# EAGLE design 612_jetracer_328_215 (EAGLE 9.6.2)
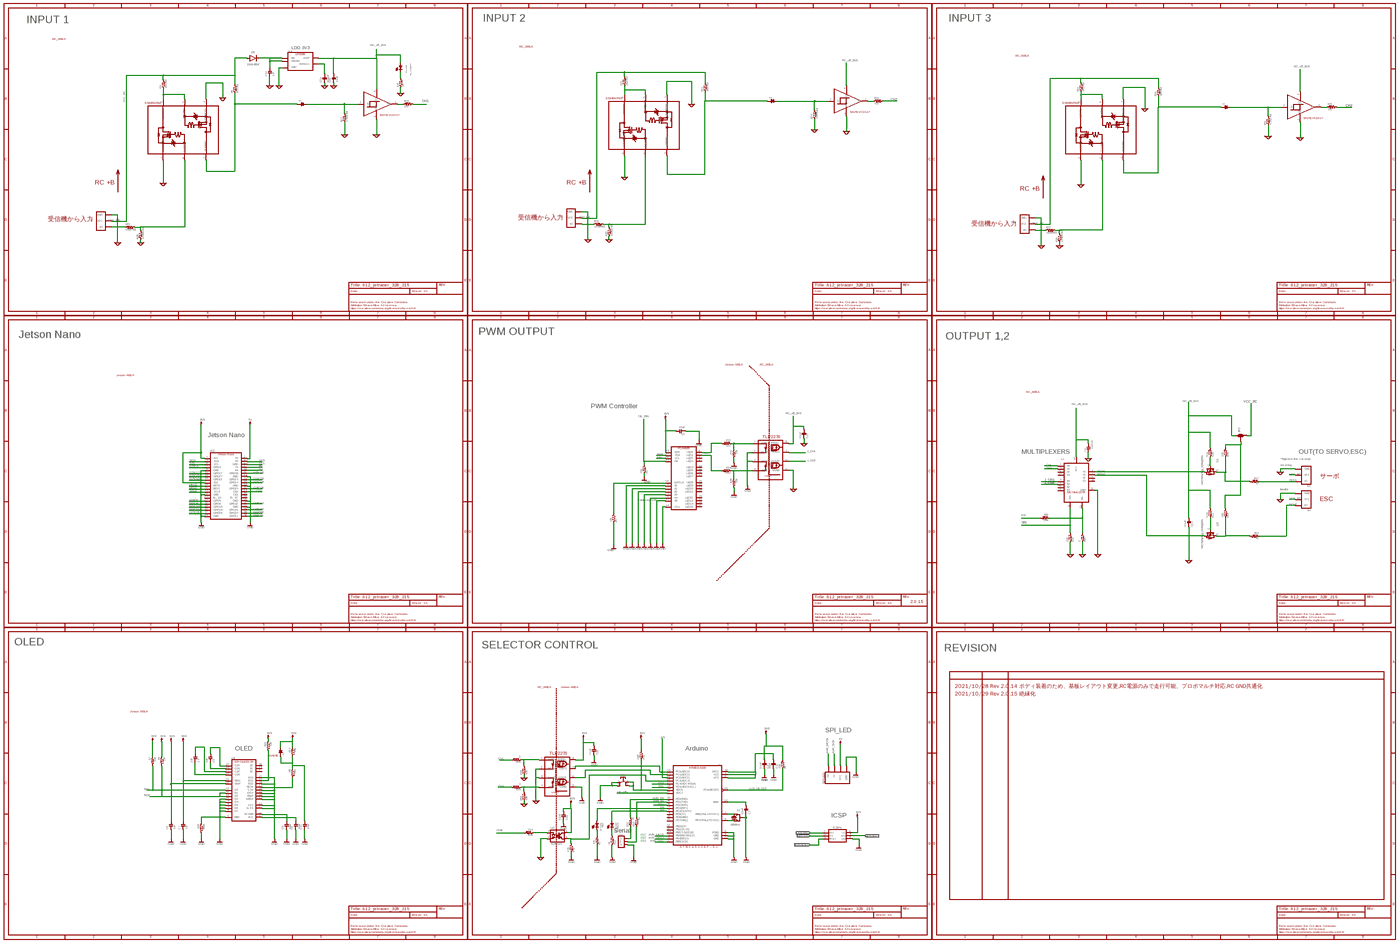
[diagram p0: schematic, sheet 1, overview]
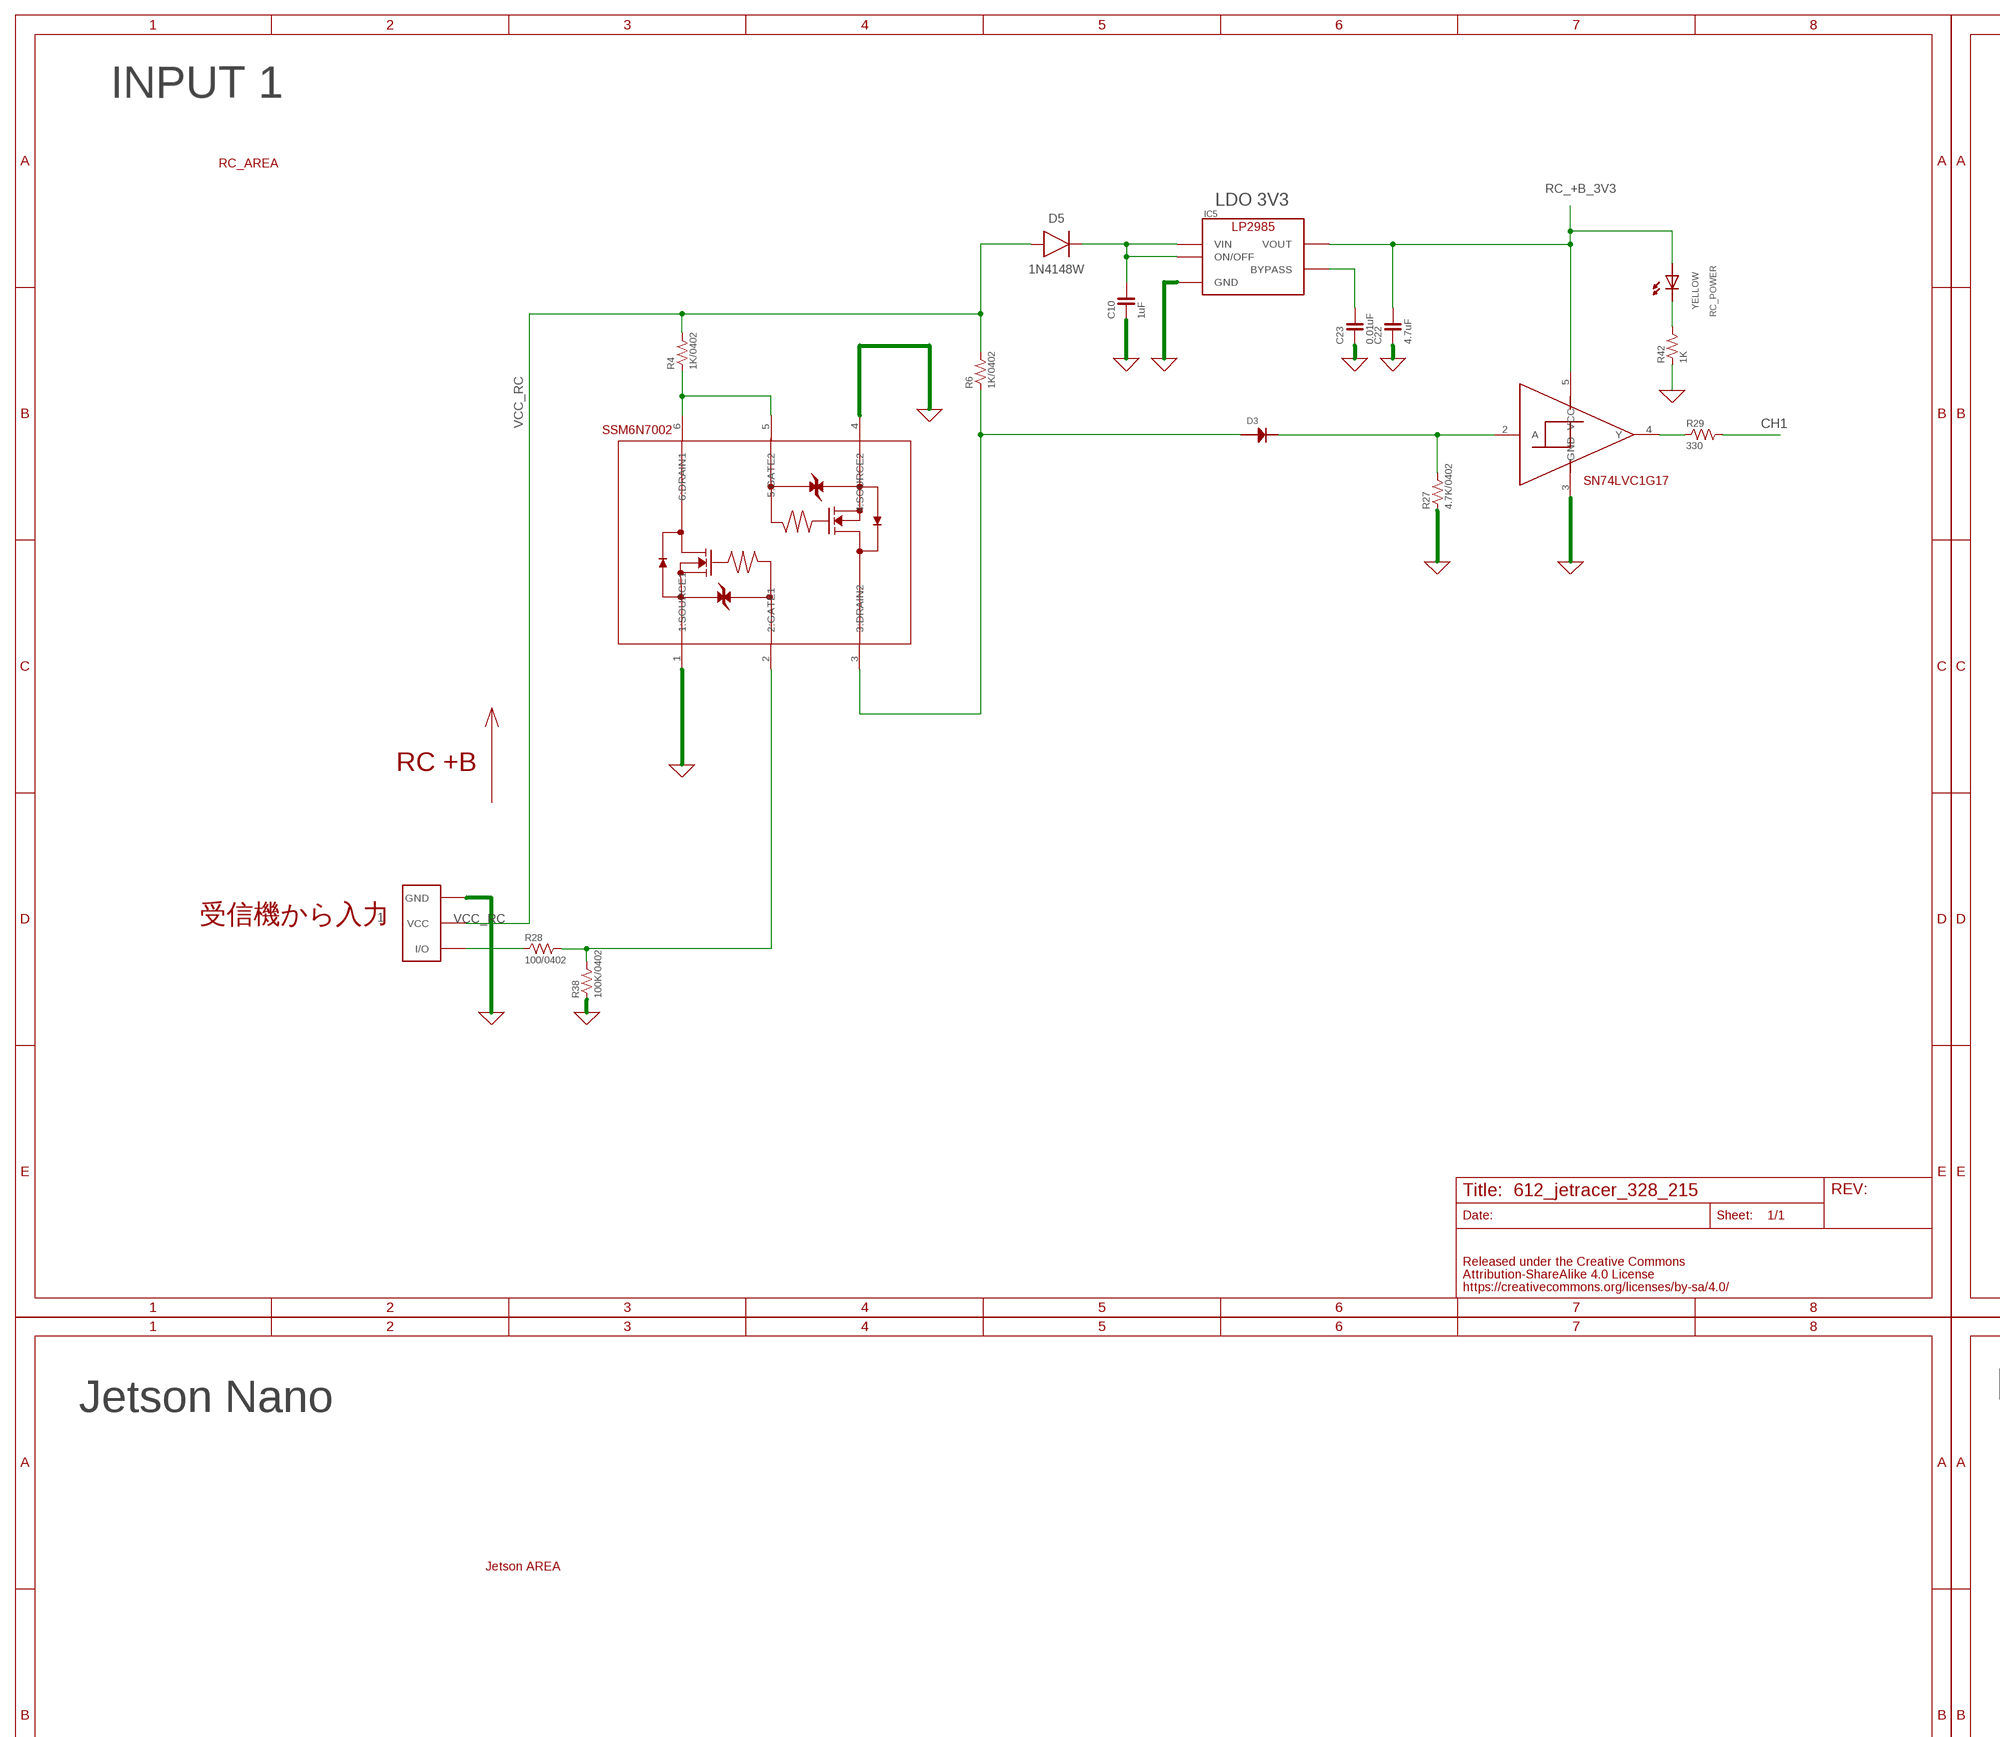
[diagram p1: schematic, sheet 1, part 1 of 8]
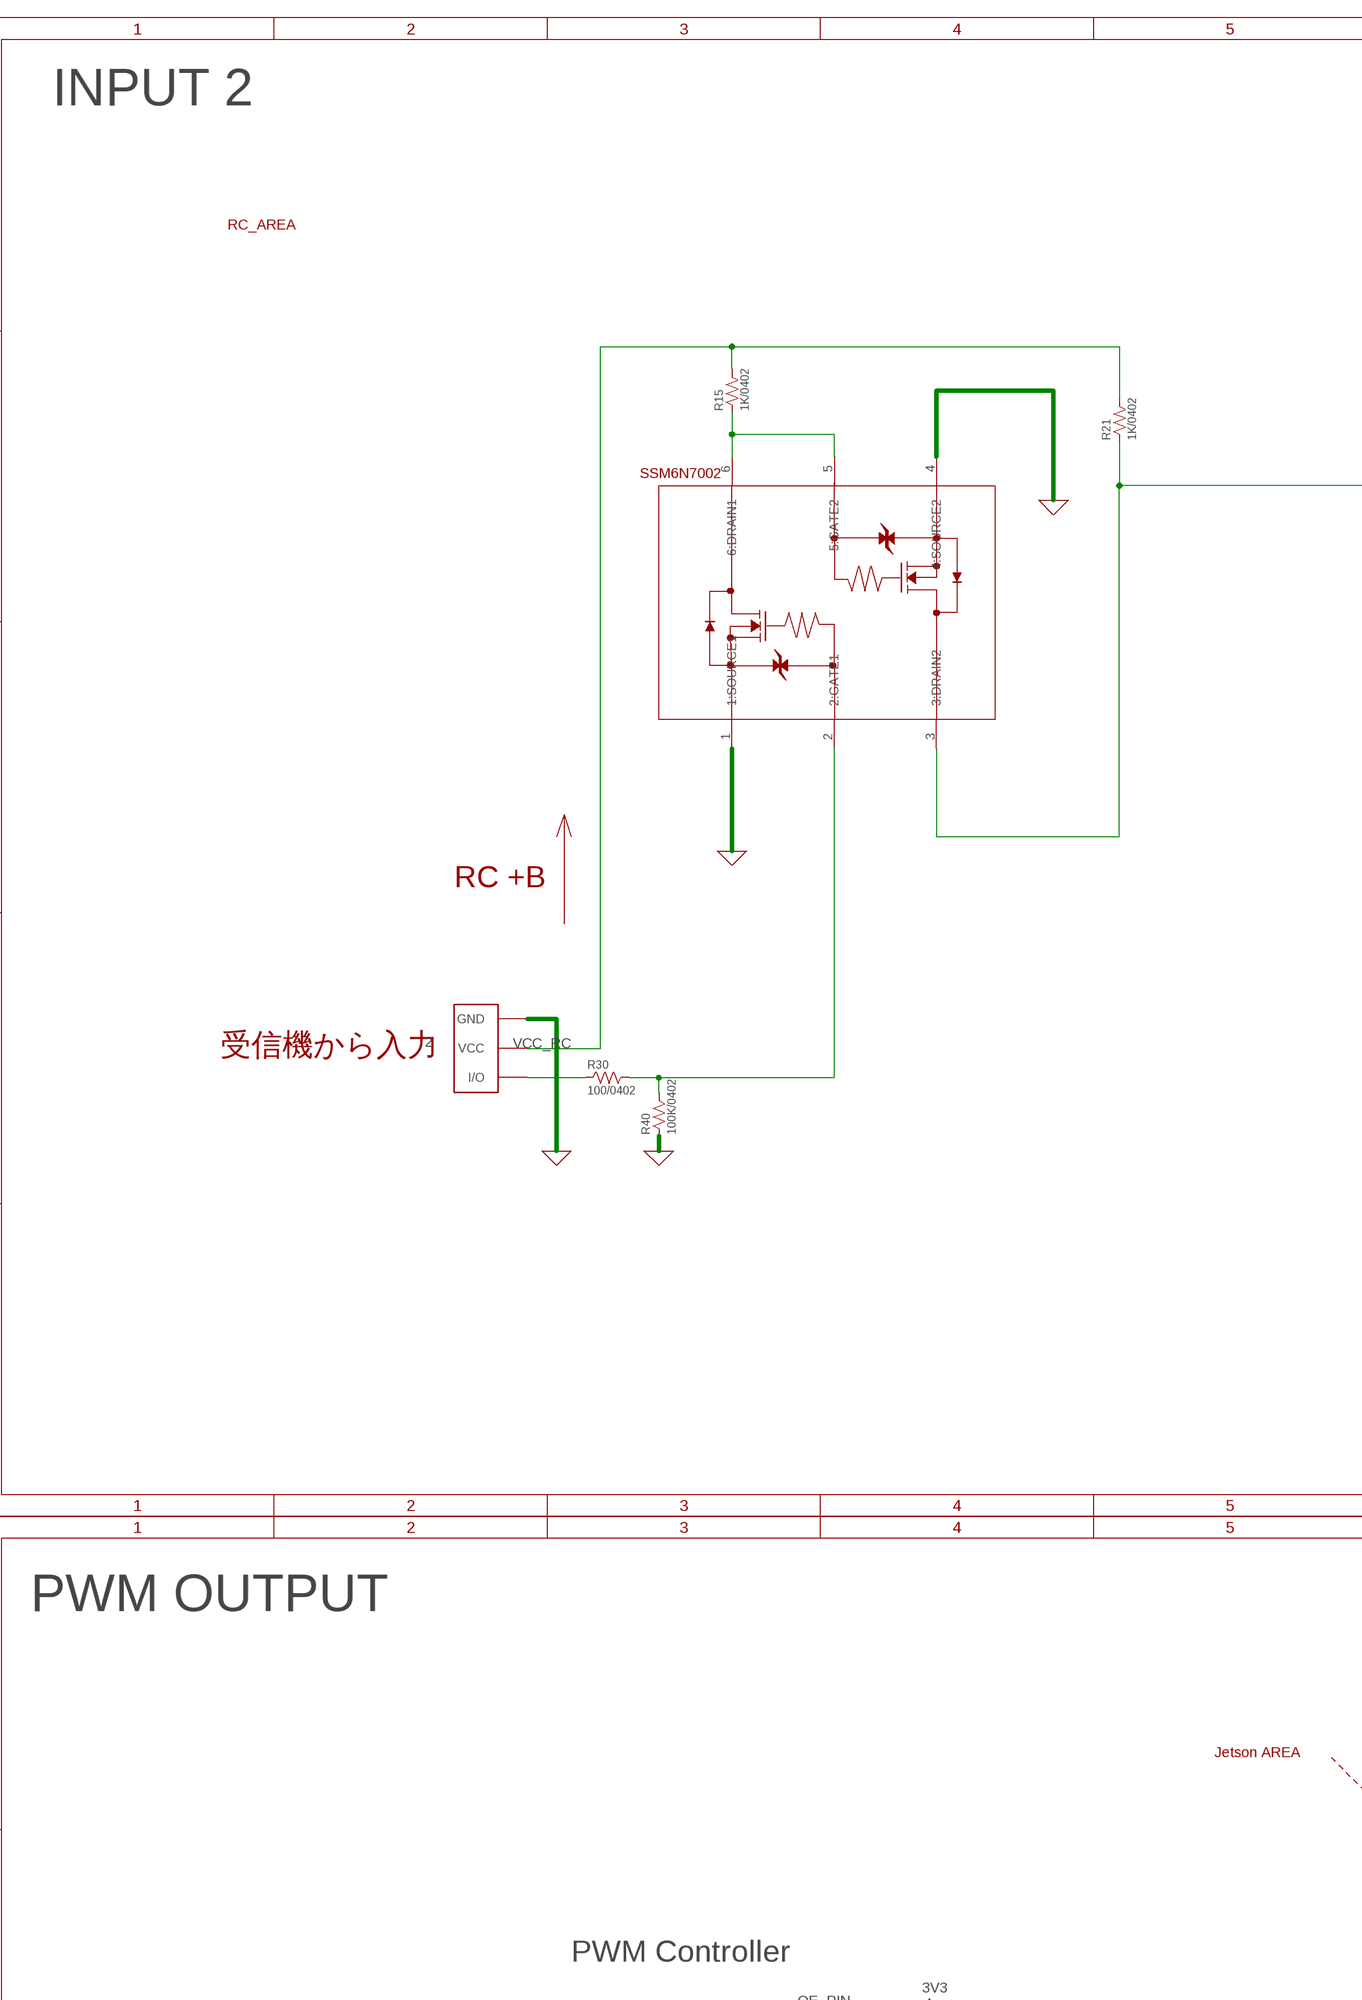
[diagram p2: schematic, sheet 1, part 2 of 8]
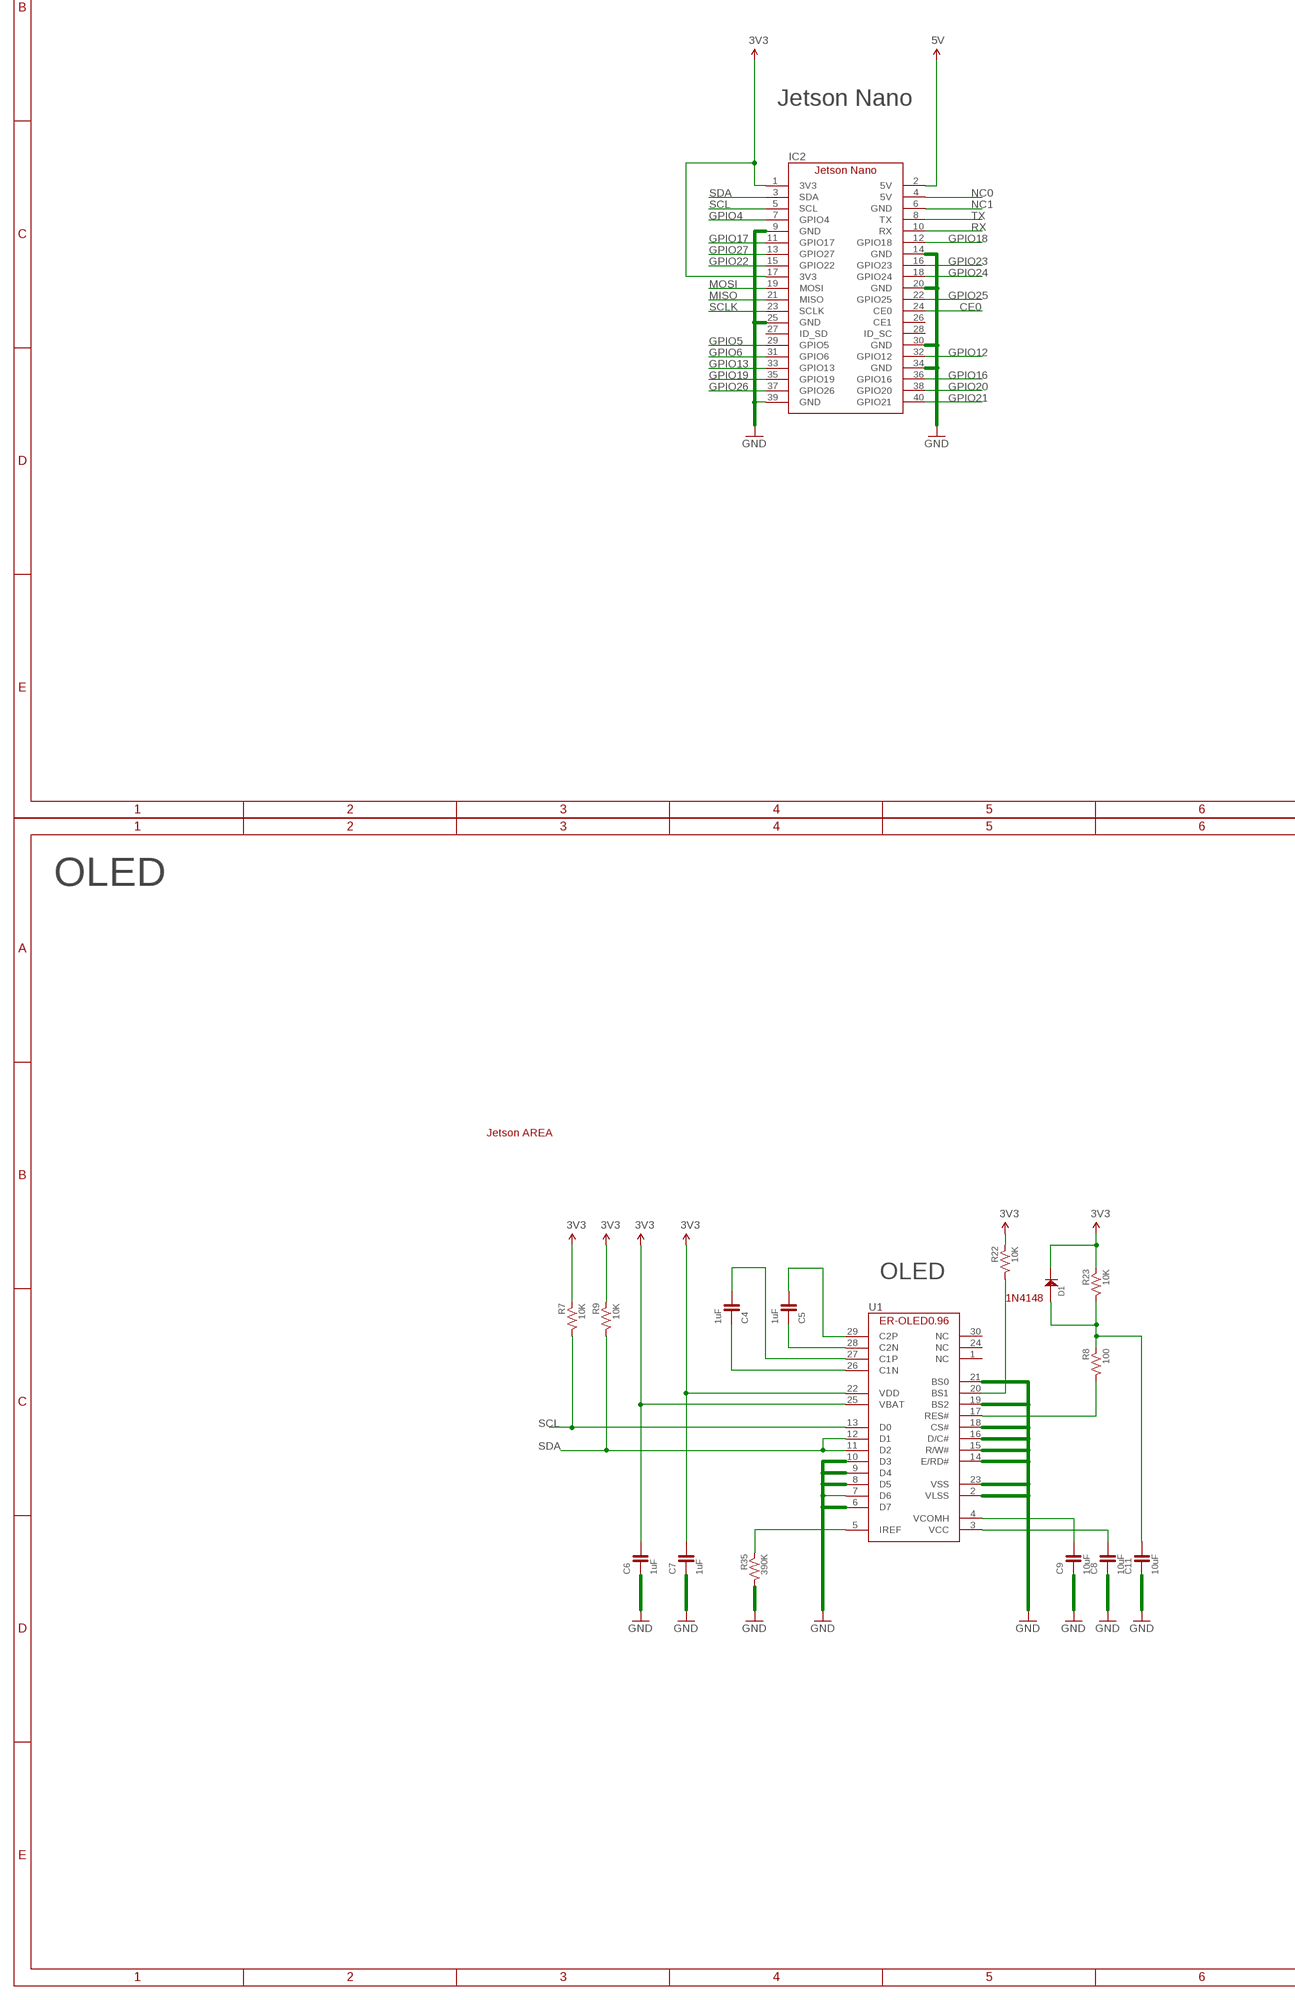
[diagram p3: schematic, sheet 1, part 3 of 8]
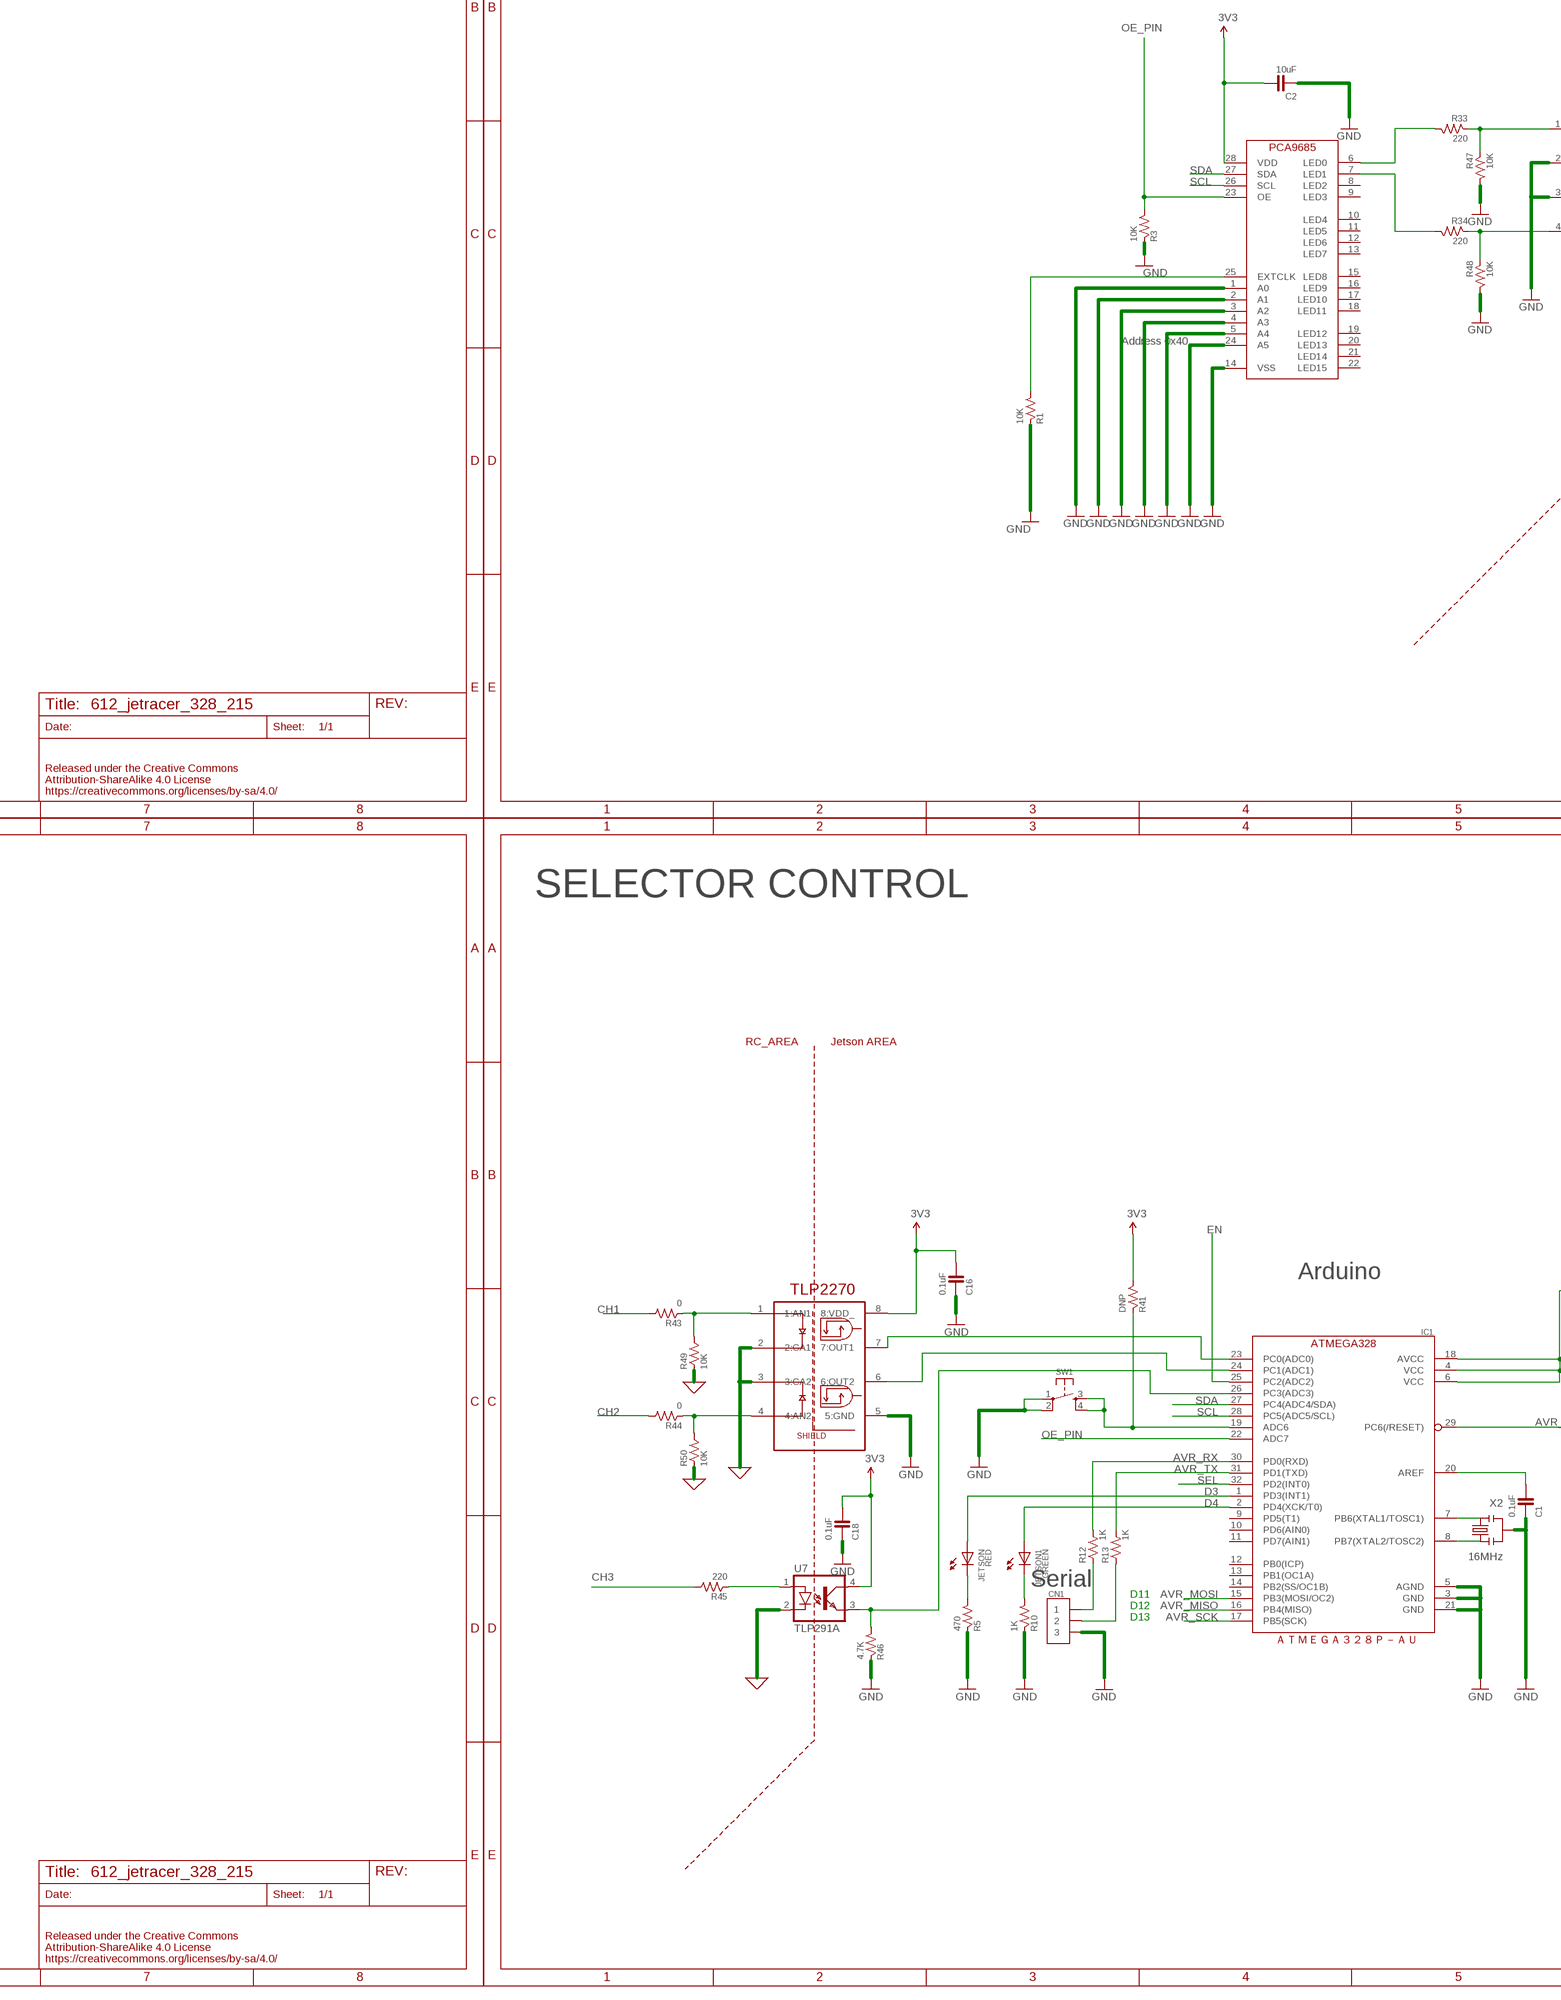
[diagram p4: schematic, sheet 1, part 4 of 8]
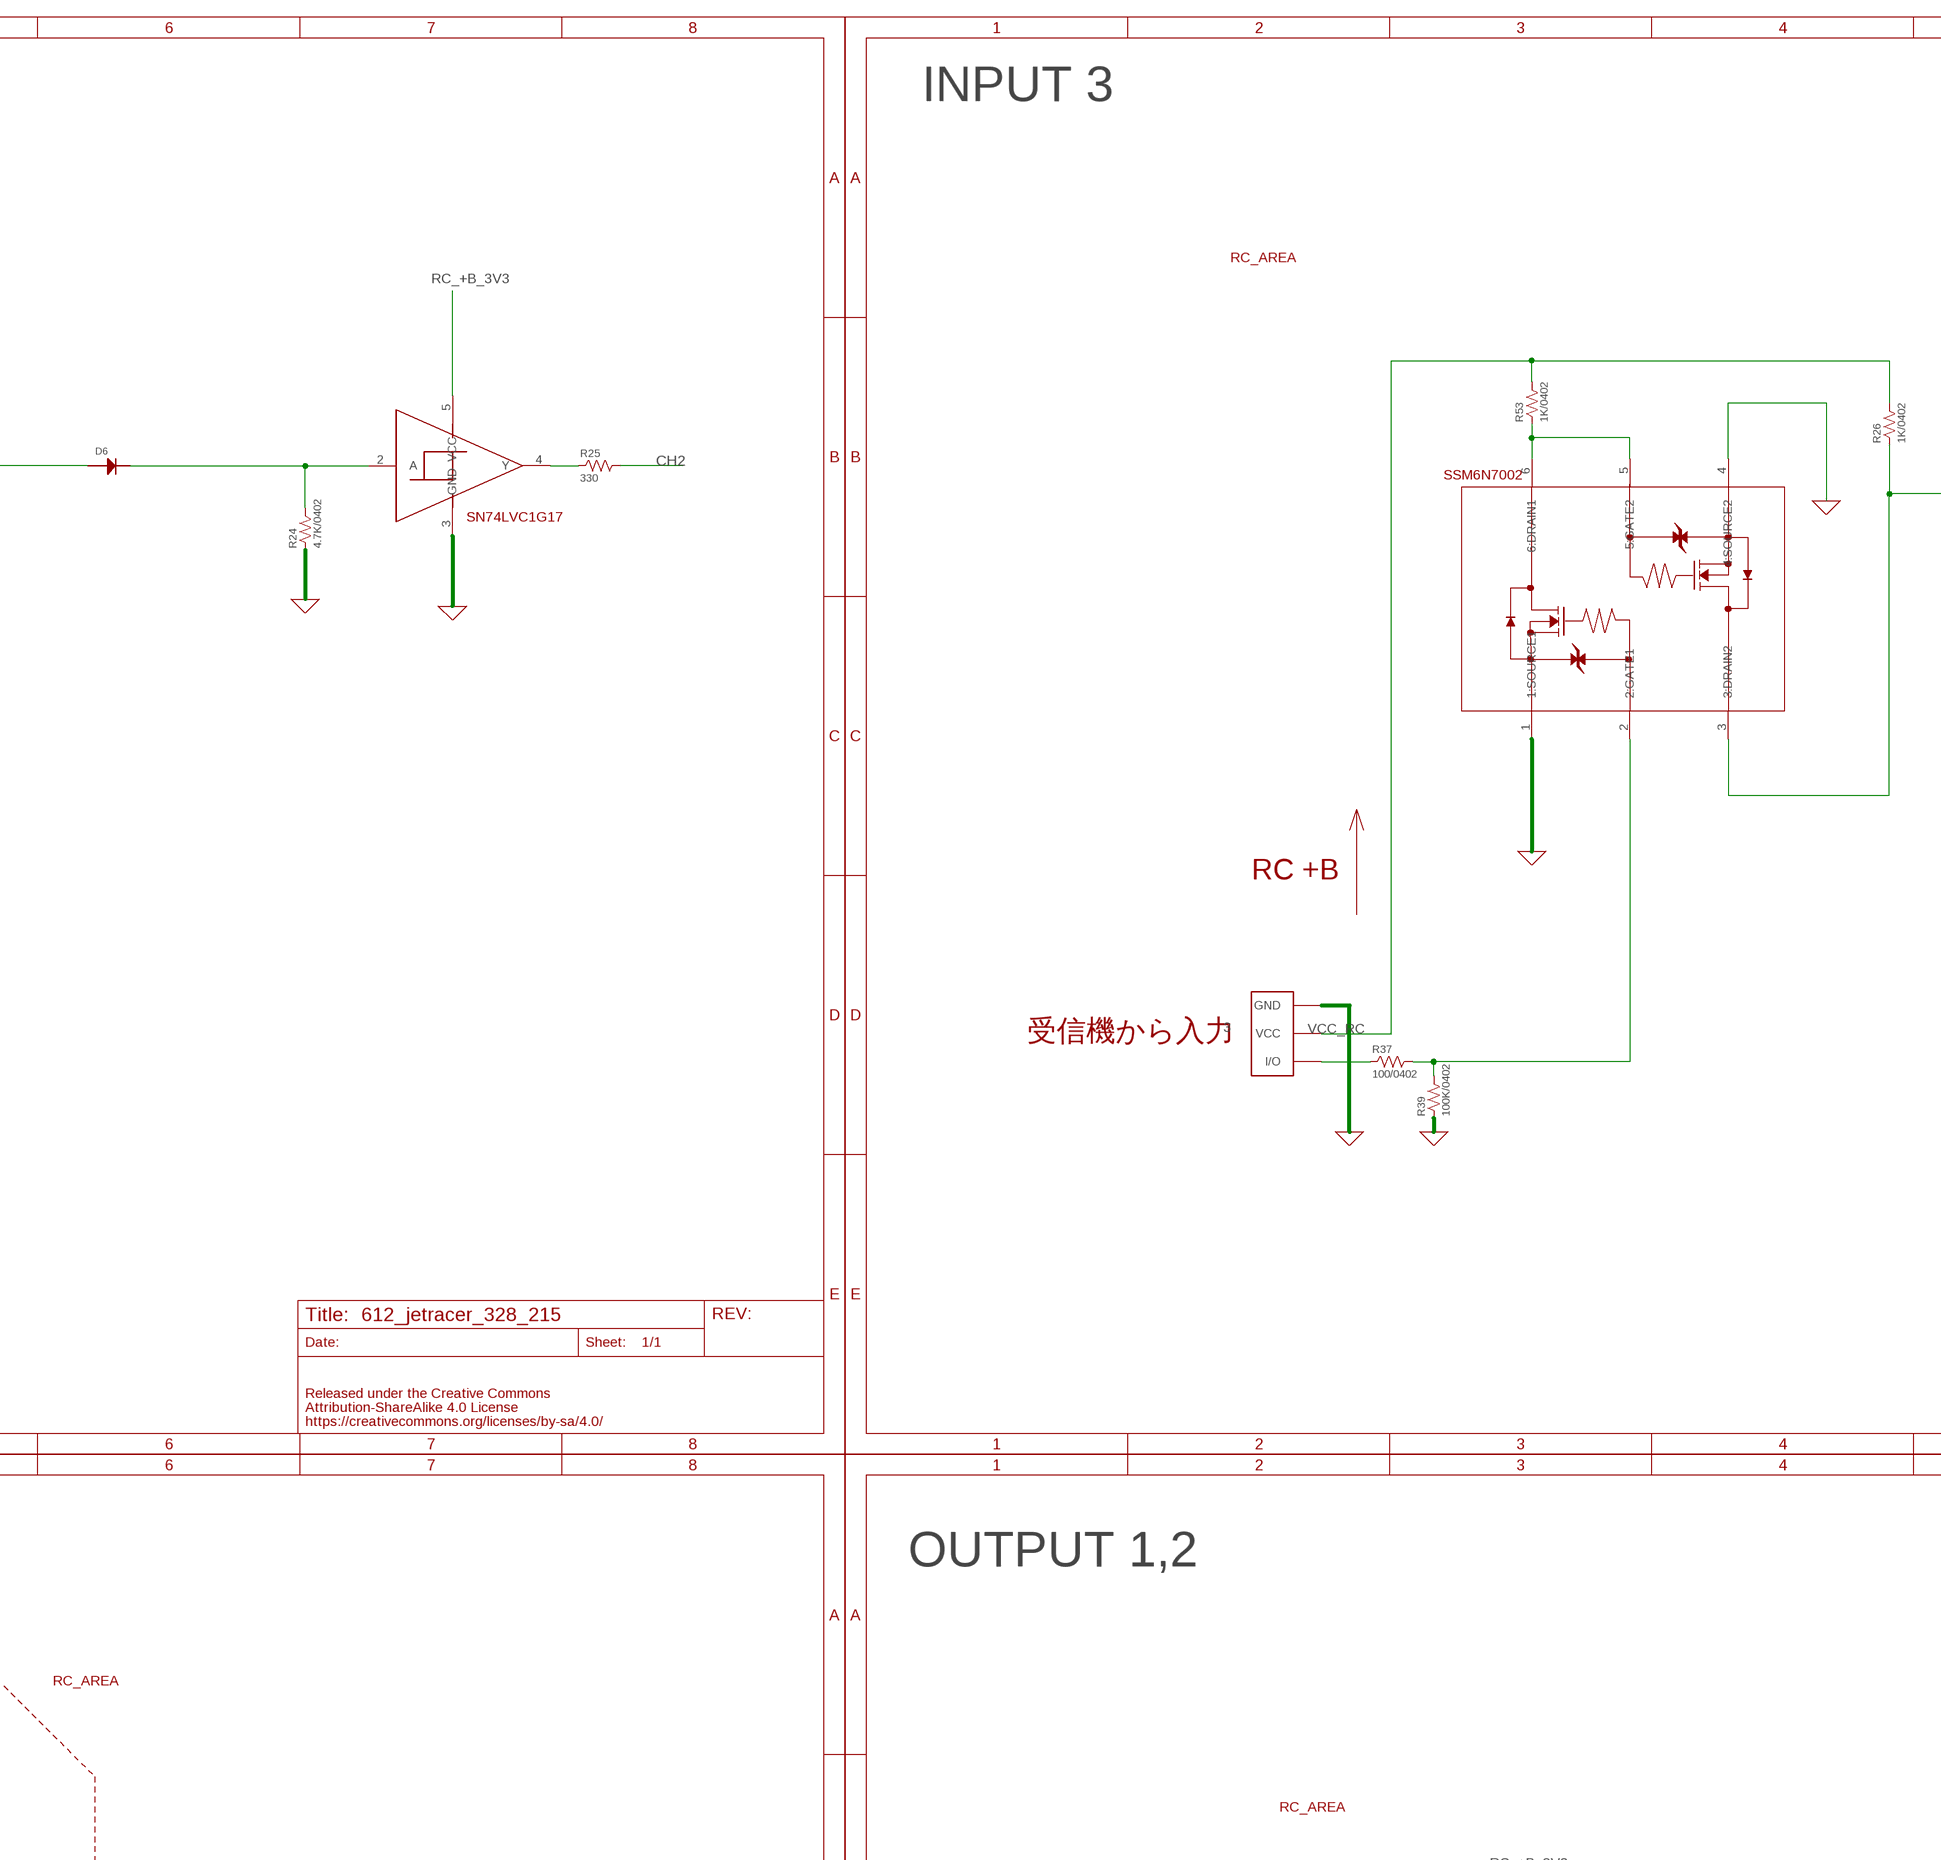
[diagram p5: schematic, sheet 1, part 5 of 8]
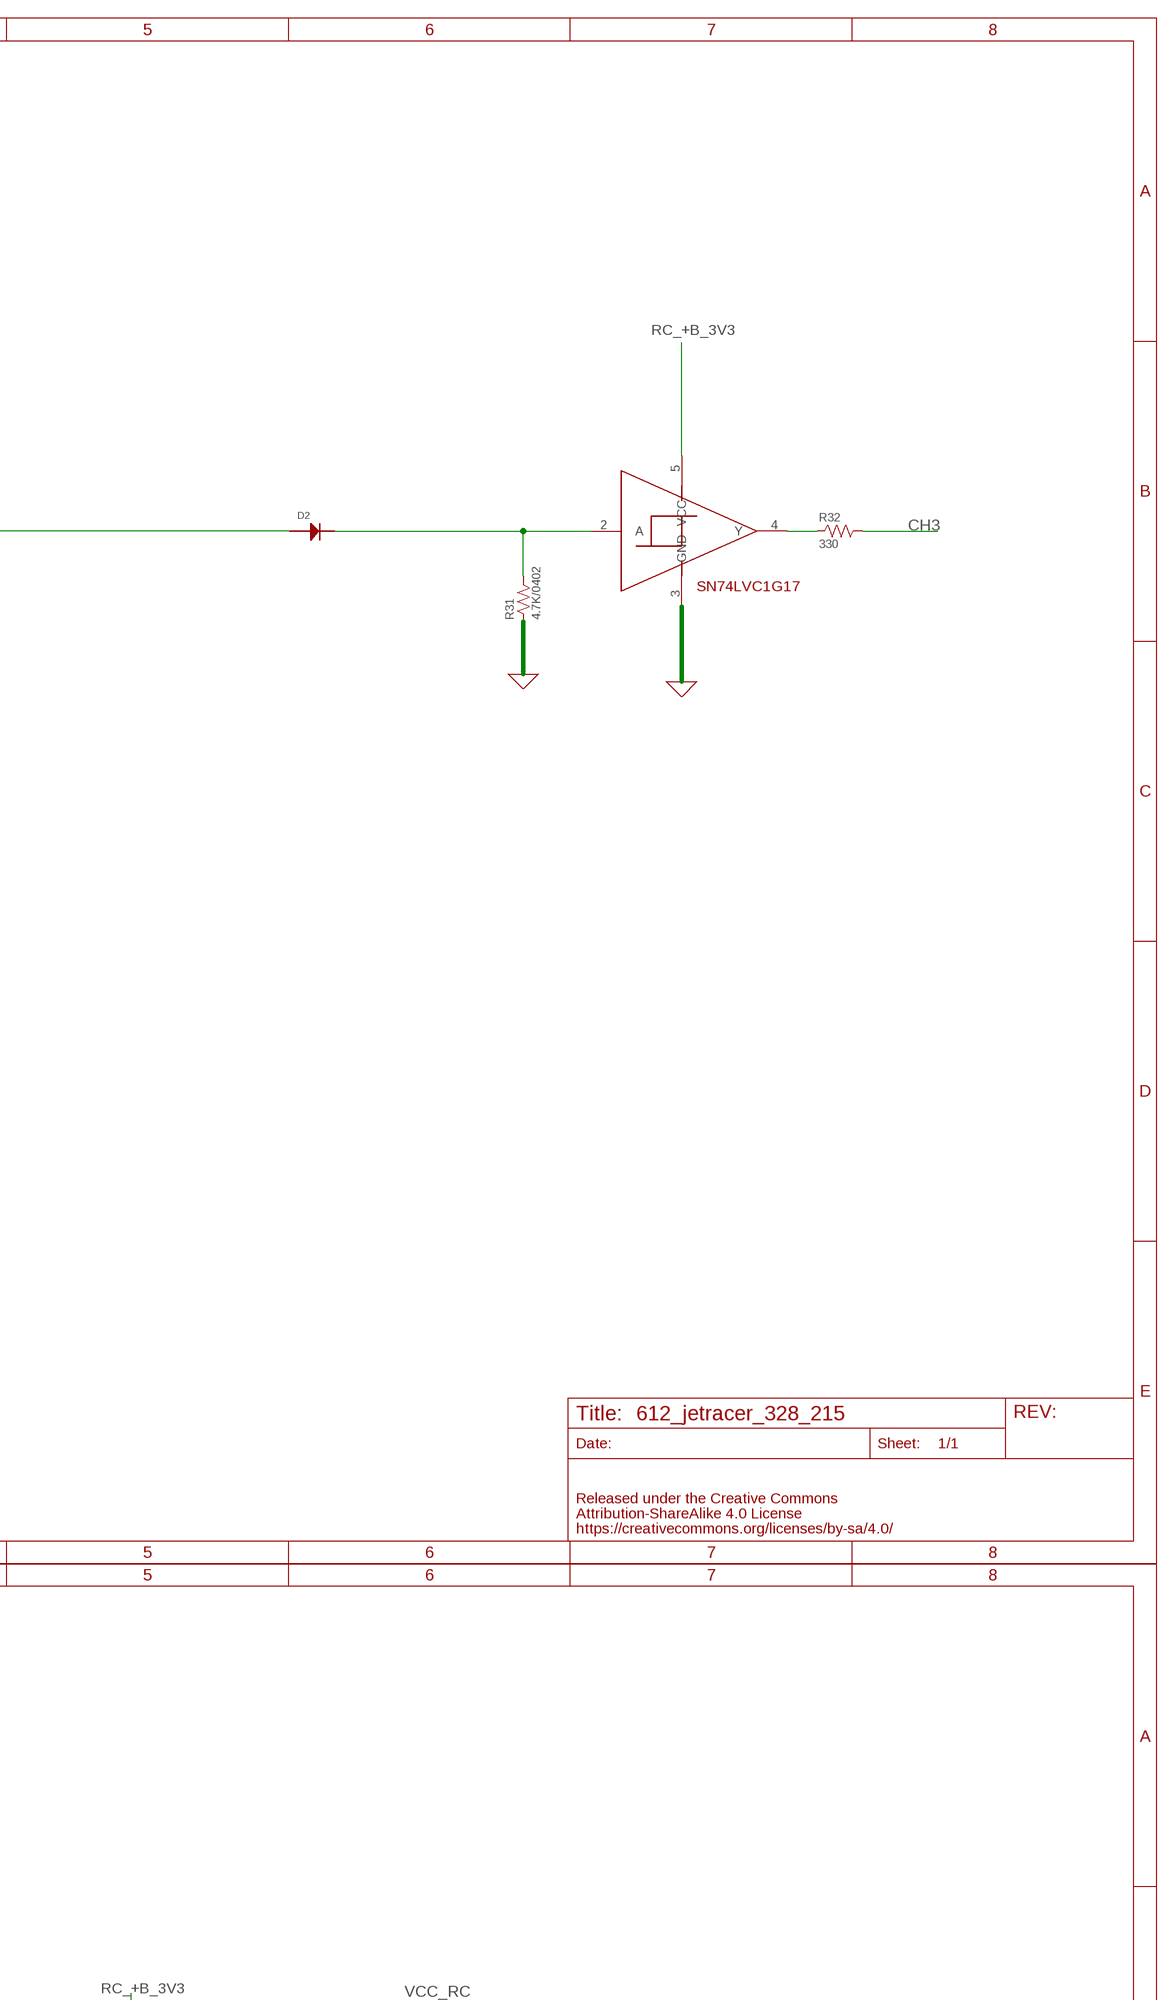
[diagram p6: schematic, sheet 1, part 6 of 8]
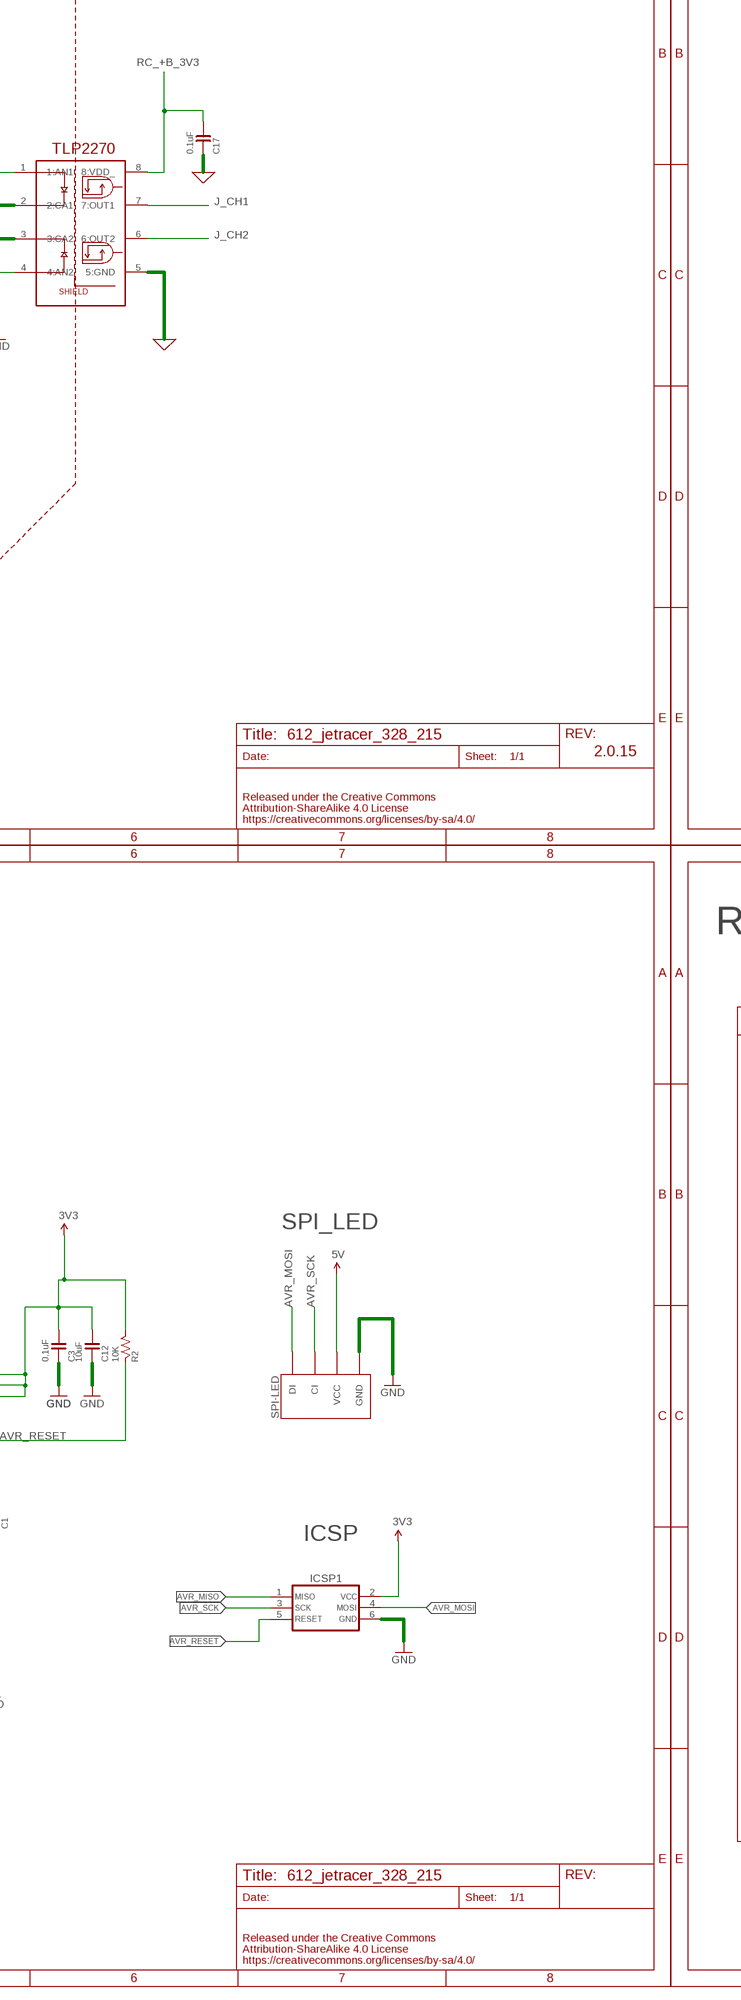
[diagram p7: schematic, sheet 1, part 7 of 8]
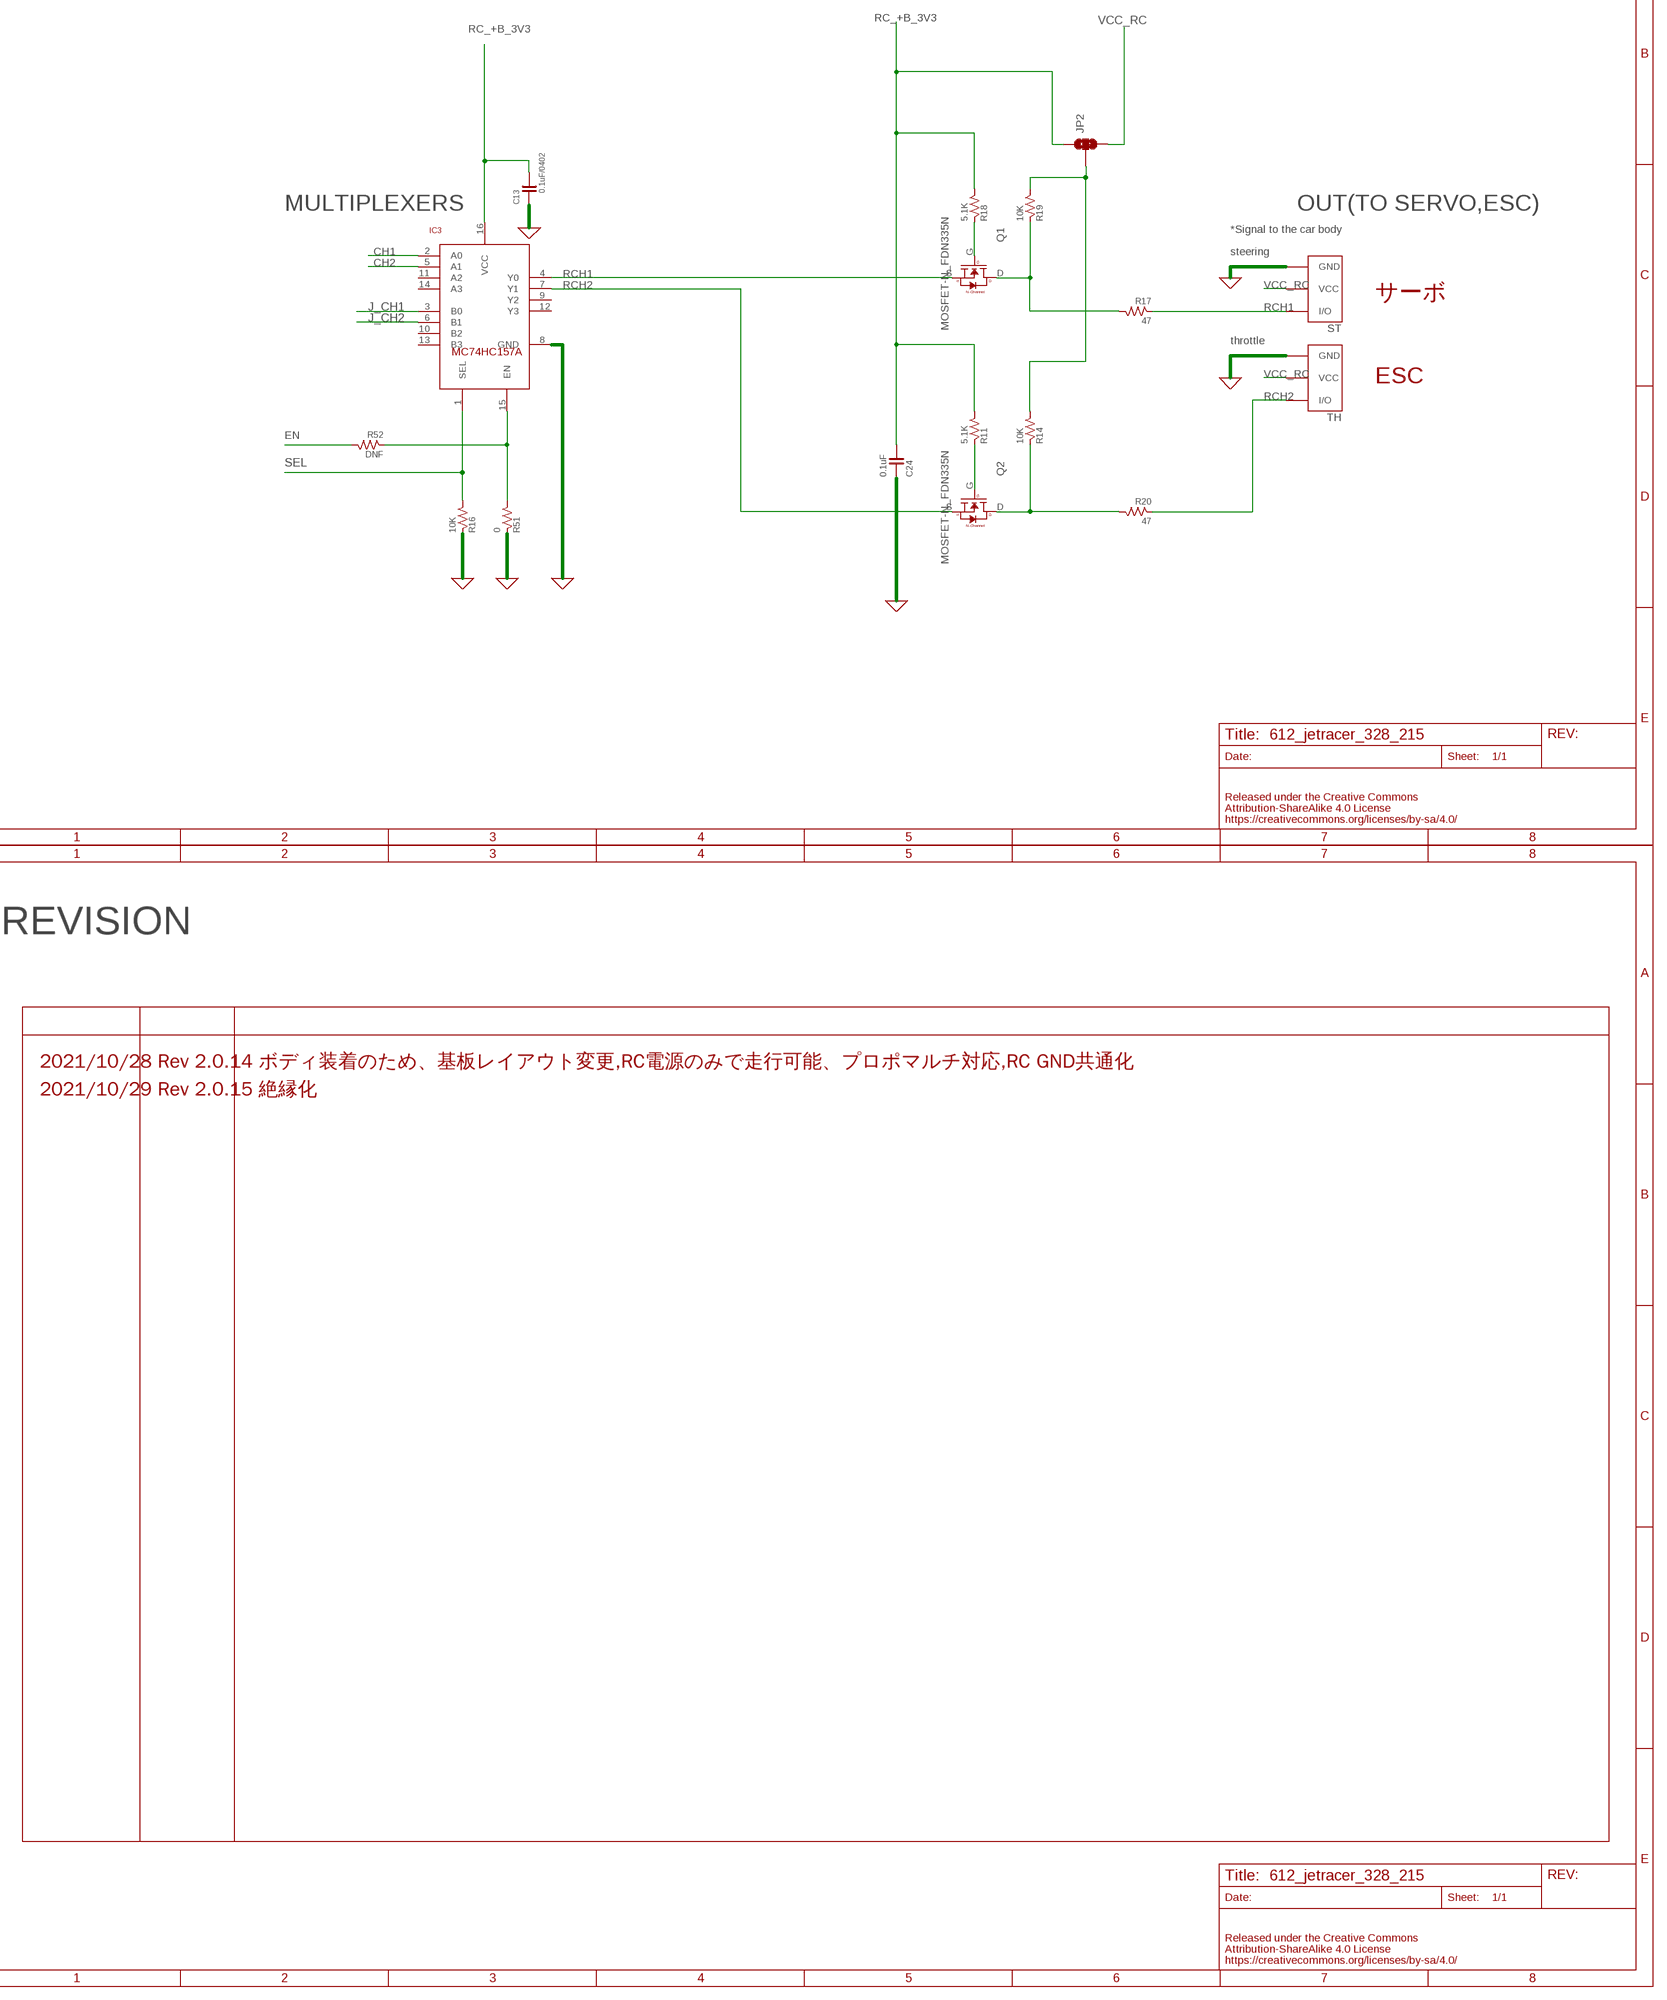
[diagram p8: schematic, sheet 1, part 8 of 8]

## Parts
1  FABO_BRICK_3PIN-HEADER  [FABO_BRICK_3PIN_HEADER]
2  FABO_BRICK_3PIN-HEADER  [FABO_BRICK_3PIN_HEADER]
3  FABO_BRICK_3PIN-HEADER  [FABO_BRICK_3PIN_HEADER]
C1  0.1uF  CAPACITOR-0603  [0603]
C2  10uF  CAPACITOR-0603  [0603]
C3  0.1uF  CAPACITOR-0603  [0603]
C4  1uF  CAPACITOR-0603  [0603]
C5  1uF  CAPACITOR-0603  [0603]
C6  1uF  CAPACITOR-0603  [0603]
C7  1uF  CAPACITOR-0603  [0603]
C8  10uF  CAPACITOR-0603  [0603]
C9  10uF  CAPACITOR-0603  [0603]
C10  1uF  CAPACITOR-0603  [0603]
C11  10uF  CAPACITOR-0603  [0603]
C12  10uF  CAPACITOR-0603  [0603]
C13  0.1uF/0402  CAPACITOR-0402  [0402]
C16  0.1uF  CAPACITOR-0603  [0603]
C17  0.1uF  CAPACITOR-0603  [0603]
C18  0.1uF  CAPACITOR-0603  [0603]
C22  4.7uF  CAPACITOR-0603  [0603]
C23  0.01uF  CAPACITOR-0603  [0603]
C24  0.1uF  CAPACITOR-0603  [0603]
CN1  PIN_1X3  [PIN_1X3]
D1  1N4148  [1N4148W]
D2  DIODE-SOD-323  [SOD-323]
D3  DIODE-SOD-323  [SOD-323]
D5  1N4148W  DIODE_1N4148W-7-F_SOD123G  [SOD3715X135]
D6  DIODE-SOD-323  [SOD-323]
IC1  ATMEGA328P-AU  [TQFP-32]
IC2  JETSON_NANO_NOBORDER  [JETSON_NANO_NOBOARDER]
IC3  MULTIPLEXERSMC74HC157A  [TSSOP-16]
IC4  PCA9685  [PCA9685]
IC5  LP2985-33DBV  [SOT-23-5]
ICSP1  ICSP_AVR-TC_NOHOLE  [TC2030]
JETSON  GREEN  LED-0603  [0603]
JETSON1  RED  LED-0603  [0603]
JP2  JUMPER-SMT_3_1-NC_TRACE_SILK  [SMT-JUMPER_3_1-NC_TRACE_SILK]
Q1  MOSFET-N_FDN335N  [SUPERSOT-3]
Q2  MOSFET-N_FDN335N  [SUPERSOT-3]
R1  10K  RESISTOR-0603  [0603]
R2  10K  RESISTOR-0603  [0603]
R3  10K  RESISTOR-0603  [0603]
R4  1K/0402  RESISTOR-0402  [0402]
R5  470  RESISTOR-0603  [0603]
R6  1K/0402  RESISTOR-0402  [0402]
R7  10K  RESISTOR-0603  [0603]
R8  100  RESISTOR-0603  [0603]
R9  10K  RESISTOR-0603  [0603]
R10  1K  RESISTOR-0603  [0603]
R11  5.1K  RESISTOR-0603  [0603]
R12  1K  RESISTOR-0603  [0603]
R13  1K  RESISTOR-0603  [0603]
R14  10K  RESISTOR-0603  [0603]
R15  1K/0402  RESISTOR-0402  [0402]
R16  10K  RESISTOR-0603  [0603]
R17  47  RESISTOR-0603  [0603]
R18  5.1K  RESISTOR-0603  [0603]
R19  10K  RESISTOR-0603  [0603]
R20  47  RESISTOR-0603  [0603]
R21  1K/0402  RESISTOR-0402  [0402]
R22  10K  RESISTOR-0603  [0603]
R23  10K  RESISTOR-0603  [0603]
R24  4.7K/0402  RESISTOR-0402  [0402]
R25  330  RESISTOR-0603  [0603]
R26  1K/0402  RESISTOR-0402  [0402]
R27  4.7K/0402  RESISTOR-0402  [0402]
R28  100/0402  RESISTOR-0402  [0402]
R29  330  RESISTOR-0603  [0603]
R30  100/0402  RESISTOR-0402  [0402]
R31  4.7K/0402  RESISTOR-0402  [0402]
R32  330  RESISTOR-0603  [0603]
R33  220  RESISTOR-0603  [0603]
R34  220  RESISTOR-0603  [0603]
R35  390K  RESISTOR-0603  [0603]
R37  100/0402  RESISTOR-0402  [0402]
R38  100K/0402  RESISTOR-0402  [0402]
R39  100K/0402  RESISTOR-0402  [0402]
R40  100K/0402  RESISTOR-0402  [0402]
R41  DNP  RESISTOR-0603  [0603]
R42  1K  RESISTOR-0603  [0603]
R43  0  RESISTOR-0603  [0603]
R44  0  RESISTOR-0603  [0603]
R45  220  RESISTOR-0603  [0603]
R46  4.7K  RESISTOR-0603  [0603]
R47  10K  RESISTOR-0603  [0603]
R48  10K  RESISTOR-0603  [0603]
R49  10K  RESISTOR-0603  [0603]
R50  10K  RESISTOR-0603  [0603]
R51  0  RESISTOR-0603  [0603]
R52  DNF  RESISTOR-0603  [0603]
R53  1K/0402  RESISTOR-0402  [0402]
RC_POWER  YELLOW  LED-0603  [0603]
SPI-LED  FABO-SPI-LED-B04B  [SPI-B04B-PASK-1]
ST  FABO_BRICK_3PIN-HEADER  [FABO_BRICK_3PIN_HEADER]
SW1  TACT-SWITCH-SMD_KMR2  [KMR2]
TH  FABO_BRICK_3PIN-HEADER  [FABO_BRICK_3PIN_HEADER]
U1  ER-OLED0.96-1ER-CON30HT-1  [ER-CON30HT-1]
U7  TLP291A  [11-3C1]
U$5  TLP2270  [TLP2270]
U$8  TLP2270  [TLP2270]
U$9  SSM6N7002KFU  [US6]
U$11  SSM6N7002KFU  [US6]
U$14  SN74LVC1G17  [SOT-23]
U$20  SN74LVC1G17  [SOT-23]
U$21  SSM6N7002KFU  [US6]
U$23  SN74LVC1G17  [SOT-23]
X2  16MHz  RESONATOR  [CSTNE_V_C]

## Nets
3V3: C2.2 C3.2 C6.2 C7.2 C12.2 C16.2 C18.2 D1.CATHODE IC1.4(VCC) IC1.6(VCC) IC1.18(AVCC) IC2.1(3V3) IC2.17(3V3) IC4.28(VDD) ICSP1.2 R2.2 R7.1 R9.1 R22.1 R23.1 R41.2 U1.22(VDD) U1.25(VBAT) U7.4(COL) U$8.8(8:VDD_)
5V: IC2.2(5V) SPI-LED.VCC
AVR_MISO: IC1.16(PB4(MISO)) ICSP1.1
AVR_MOSI: IC1.15(PB3(MOSI/OC2)) ICSP1.4 SPI-LED.DI
AVR_RESET: IC1.29(PC6(/RESET)) ICSP1.5 R2.1
AVR_RX: IC1.30(PD0(RXD)) R12.2
AVR_SCK: IC1.17(PB5(SCK)) ICSP1.3 SPI-LED.CI
AVR_TX: IC1.31(PD1(TXD)) R13.2
CE0: IC2.24(CE0)
CH1: IC3.2(A0) R29.2 R43.2
CH2: IC3.5(A1) R25.2 R44.2
CH3: R32.2 R45.2
D3: IC1.1(PD3(INT1)) JETSON1.ANODE
D4: IC1.2(PD4(XCK/T0)) JETSON.ANODE
EN: IC1.25(PC2(ADC2)) R52.2
GND: C1.1 C2.1 C3.1 C6.1 C7.1 C8.1 C9.1 C11.1 C12.1 C16.1 C18.1 CN1.3 IC1.3(GND) IC1.5(AGND) IC1.21(GND) IC2.9(GND) IC2.14(GND) IC2.20(GND) IC2.25(GND) IC2.30(GND) IC2.34(GND) IC2.39(GND) IC4.1(A0) IC4.2(A1) IC4.3(A2) IC4.4(A3) IC4.5(A4) IC4.14(VSS) IC4.24(A5) ICSP1.6 R1.1 R3.1 R5.1 R10.1 R35.2 R46.1 R47.2 R48.2 SPI-LED.GND SW1.1 SW1.2 U1.2(VLSS) U1.6(D7) U1.7(D6) U1.8(D5) U1.9(D4) U1.10(D3) U1.14(E/RD#) U1.15(R/W#) U1.16(D/C#) U1.18(CS#) U1.19(BS2) U1.21(BS0) U1.23(VSS) U$5.2(2:CA1) U$5.3(3:CA2) U$8.5(5:GND) X2.2
GPIO4: IC2.7(GPIO4)
GPIO5: IC2.29(GPIO5)
GPIO6: IC2.31(GPIO6)
GPIO12: IC2.32(GPIO12)
GPIO13: IC2.33(GPIO13)
GPIO16: IC2.36(GPIO16)
GPIO17: IC2.11(GPIO17)
GPIO18: IC2.12(GPIO18)
GPIO19: IC2.35(GPIO19)
GPIO20: IC2.38(GPIO20)
GPIO21: IC2.40(GPIO21)
GPIO22: IC2.15(GPIO22)
GPIO23: IC2.16(GPIO23)
GPIO24: IC2.18(GPIO24)
GPIO25: IC2.22(GPIO25)
GPIO26: IC2.37(GPIO26)
GPIO27: IC2.13(GPIO27)
J_CH1: IC3.3(B0) U$5.7(7:OUT1)
J_CH2: IC3.6(B1) U$5.6(6:OUT2)
MISO: IC2.21(MISO)
MOSI: IC2.19(MOSI)
N$2: R28.2 R38.2 U$9.2(2:GATE1)
N$3: Q1.D R17.2 R19.1
N$4: C1.2 IC1.20(AREF)
N$5: IC1.8(PB7(XTAL2/TOSC2)) X2.3
N$6: CN1.1 R12.1
N$7: IC1.19(ADC6) R41.1 SW1.3 SW1.4
N$8: IC4.25(EXTCLK) R1.2
N$9: Q2.D R14.1 R20.2
N$10: R17.1 ST.I/O
N$11: R30.2 R40.2 U$11.2(2:GATE1)
N$12: D3.A(ANODE) R6.1 U$9.3(3:DRAIN2)
N$13: 2.I/O R30.1
N$14: R20.1 TH.I/O
N$15: IC1.7(PB6(XTAL1/TOSC1)) X2.1
N$16: C4.2 U1.27(C1P)
N$17: CN1.2 R13.1
N$18: R15.1 U$11.5(5:GATE2) U$11.6(6:DRAIN1)
N$19: JETSON1.CATHODE R5.2
N$20: JETSON.CATHODE R10.2
N$21: C4.1 U1.26(C1N)
N$22: C5.1 U1.28(C2N)
N$23: C5.2 U1.29(C2P)
N$24: R35.1 U1.5(IREF)
N$25: C9.2 U1.4(VCOMH)
N$26: C8.2 U1.3(VCC)
N$27: R8.2 U1.17(RES#)
N$28: C11.2 D1.ANODE R8.1 R23.2
N$29: D6.A(ANODE) R21.1 U$11.3(3:DRAIN2)
N$30: D6.K(CATHODE) R24.2 U$20.2(A)
N$31: R25.1 U$20.4(Y)
N$32: 3.I/O R37.1
N$33: R53.1 U$21.5(5:GATE2) U$21.6(6:DRAIN1)
N$34: D3.K(CATHODE) R27.2 U$14.2(A)
N$35: R29.1 U$14.4(Y)
N$36: D2.A(ANODE) R26.1 U$21.3(3:DRAIN2)
N$37: D2.K(CATHODE) R31.2 U$23.2(A)
N$38: R32.1 U$23.4(Y)
N$39: Q2.G R11.1
N$40: Q1.G R18.1
N$41: JP2.2 R14.2 R19.2
N$42: IC4.6(LED0) R33.2
N$43: IC4.7(LED1) R34.2
N$44: 1.I/O R28.1
N$45: IC3.15(EN) R51.2 R52.1
N$46: R37.2 R39.2 U$21.2(2:GATE1)
N$47: C23.2 IC5.4(BYPASS)
N$48: C10.2 D5.1(C) IC5.1(VIN) IC5.3(ON/OFF)
N$49: R42.2 RC_POWER.CATHODE
N$50: R22.2 U1.20(BS1)
N$53: R33.1 R47.1 U$5.1(1:AN1)
N$54: R34.1 R48.1 U$5.4(4:AN2)
N$55: IC1.23(PC0(ADC0)) U$8.7(7:OUT1)
N$56: IC1.24(PC1(ADC1)) U$8.6(6:OUT2)
N$57: R43.1 R49.2 U$8.1(1:AN1)
N$58: R44.1 R50.2 U$8.4(4:AN2)
N$59: R45.1 U7.1(A)
N$60: IC1.26(PC3(ADC3)) R46.2 U7.3(EMI)
N$61: R4.1 U$9.5(5:GATE2) U$9.6(6:DRAIN1)
NC0: IC2.4(5V)
NC1: IC2.6(GND)
OE_PIN: IC1.22(ADC7) IC4.23(OE) R3.2
RC_+B_3V3: C13.2 C17.2 C22.2 C24.2 IC3.16(VCC) IC5.5(VOUT) JP2.1 R11.2 R18.2 RC_POWER.ANODE U$5.8(8:VDD_) U$14.5(VCC) U$20.5(VCC) U$23.5(VCC)
RC_GND: 1.GND 2.GND 3.GND C10.1 C13.1 C17.1 C22.1 C23.1 C24.1 IC3.8(GND) IC5.2(GND) R16.1 R24.1 R27.1 R31.1 R38.1 R39.1 R40.1 R42.1 R49.1 R50.1 R51.1 ST.GND TH.GND U7.2(C) U$5.5(5:GND) U$8.2(2:CA1) U$8.3(3:CA2) U$9.1(1:SOURCE1) U$9.4(4:SOURCE2) U$11.1(1:SOURCE1) U$11.4(4:SOURCE2) U$14.3(GND) U$20.3(GND) U$21.1(1:SOURCE1) U$21.4(4:SOURCE2) U$23.3(GND) ; supply symbol labelled GND
RCH1: IC3.4(Y0) Q1.S
RCH2: IC3.7(Y1) Q2.S
RX: IC2.10(RX)
SCL: IC1.28(PC5(ADC5/SCL)) IC2.5(SCL) IC4.26(SCL) R7.2 U1.13(D0)
SCLK: IC2.23(SCLK)
SDA: IC1.27(PC4(ADC4/SDA)) IC2.3(SDA) IC4.27(SDA) R9.2 U1.11(D2) U1.12(D1)
SEL: IC1.32(PD2(INT0)) IC3.1(SEL) R16.2
TX: IC2.8(TX)
VCC_RC: 1.VCC 2.VCC 3.VCC D5.2(A) JP2.3 R4.2 R6.2 R15.2 R21.2 R26.2 R53.2 ST.VCC TH.VCC
Unconnected: IC1.9(PD5(T1)) IC1.10(PD6(AIN0)) IC1.11(PD7(AIN1)) IC1.12(PB0(ICP)) IC1.13(PB1(OC1A)) IC1.14(PB2(SS/OC1B)) IC2.26(CE1) IC2.27(ID_SD) IC2.28(ID_SC) IC3.9(Y2) IC3.10(B2) IC3.11(A2) IC3.12(Y3) IC3.13(B3) IC3.14(A3) IC4.8(LED2) IC4.9(LED3) IC4.10(LED4) IC4.11(LED5) IC4.12(LED6) IC4.13(LED7) IC4.15(LED8) IC4.16(LED9) IC4.17(LED10) IC4.18(LED11) IC4.19(LED12) IC4.20(LED13) IC4.21(LED14) IC4.22(LED15) U1.1(NC) U1.24(NC) U1.30(NC)

## Notes on the sheet
- INPUT 1 | INPUT 2 | INPUT 3
- RC_AREA
- RC_AREA
- LDO 3V3
- RC_AREA
- SN74LVC1G17
- SN74LVC1G17
- SN74LVC1G17
- RC +B | RC +B
- RC +B
- 受信機から入力 | 受信機から入力
- 受信機から入力
- Jetson Nano | PWM OUTPUT
- OUTPUT 1,2
- Jetson AREA | RC_AREA
- Jetson AREA
- RC_AREA
- PWM Controller
- Jetson Nano
- MULTIPLEXERS | OUT(TO SERVO,ESC)
- *Signal to the car body
- steering
- サーボ
- throttle
- MC74HC157A
- Address 0x40 | ESC
- 2.0.15
- OLED | SELECTOR CONTROL
- REVISION
- RC_AREA | Jetson AREA | 2021/10/28 Rev 2.0.14 ボディ装着のため、基板レイアウト変更,RC電源のみで走行可能、プロポマルチ対応,RC GND共通化
- 2021/10/29 Rev 2.0.15 絶縁化
- Jetson AREA
- SPI_LED
- OLED | Arduino
- 1N4148
- ICSP
- Serial
- D11
- D12
- D13
- ＡＴＭＥＧＡ３２８Ｐ－ＡＵ

## Library data of the parts
1-3 ST TH = FaBo-Template:FABO_BRICK_3PIN: FaBo Brick 3pin
C1-C13 C16-C18 C22 C23 = FaBo-Capacitor:CAPACITOR: CAPACITOR
C24 = FaBo-Capacitor:CAPACITOR: CAPACITOR; SPICEPREFIX: C
CN1 = FaBo-PIN:PIN_1X3
D1 = FaBo-Diode:1N4148
D2 D3 D6 = FaBo-Diode:DIODE
D5 = Diode:DIODE_: Diode Rectifier - Popular parts; CATEGORY: Diode; DESCRIPTION: DIODE GEN PURP 100V 300MA SOD123; MANUFACTURER: Diodes Incorporated; SUB-CATEGORY: Rectifier
IC1 = component:ATMEGA328
IC2 = FaBo-Boards:JETSON_NANO
IC3 = FaBo-Multiplexers:MULTIPLEXERS
IC4 = FaBo-Motor:PCA9685
IC5 = FaBo-Supply:LP2985: LP2985
ICSP1 = component:ICSP_AVR
JETSON JETSON1 RC_POWER = FaBo-LED:LED
JP2 = SparkFun-Jumpers:JUMPER-SMT_3_1-NC_TRACE: Normally closed trace jumper (1 of 2 connections) This jumper has a trace between two pads so it's normally closed (NC). The other connection is normally open (NO). Use a razor knife to open the connection. For best results follow the IPC guidelines for cutting traces: Cutout at least 0.063 mm (0.005 in). Remove all loose material to clean up the cut area. Seal the cut with an approved epoxy. Reapply solder to reclose the connection, or to close the NO connection.
Q1 Q2 = FaBo-Mosfet:MOSFET-N
R1-R35 R37-R53 = FaBo-Resistors:RESISTOR: RESISTOR
SPI-LED = FaBo-Connetor:FABO-SPI-LED
SW1 = FaBo-Switch:TACT-SWITCH: Part No Maker Datasheet Distributor 1273HA-160G-G SWITRONIC Catalog <http://www.switronic.com/uploads/images/A10.gif> Akizuki <http://akizukidenshi.com/catalog/g/gP-02561/> DTS-6-V Cosland DTS 6 Series <http://www.cosland.com/newproduct/DTS%20SERIES.pdf> Akizuki <http://akizukidenshi.com/catalog/g/gP-03647/> KMR2 C&K KMR2 SERIES <https://www.ckswitches.com/products/switches/product-details/Tactile/KMR2/> Octoparts Result <https://octopart.com/search?q=KMR2&start=0> TSHA-T-XB2-19E TOP UP INDUSTORY TSHA-T <http://www.top-up.com.tw/front/bin/ptdetail.phtml?Part=TSHA-T> Akizuki <http://akizukidenshi.com/catalog/g/gP-09361/>
U1 = FaBo-Display:ER-OLED0.96-1
U7 = FaBo_Photocoupler:TLP291A; SPICEPREFIX: E
U$5 U$8 = FaBo_Photocoupler:TLP2270
U$9 U$11 U$21 = FaBo-Mosfet:SSM6N7002KFU
U$14 U$20 U$23 = FaBo-LogicIC:SN74LVC1G17
X2 = component:RESONATOR

## Board
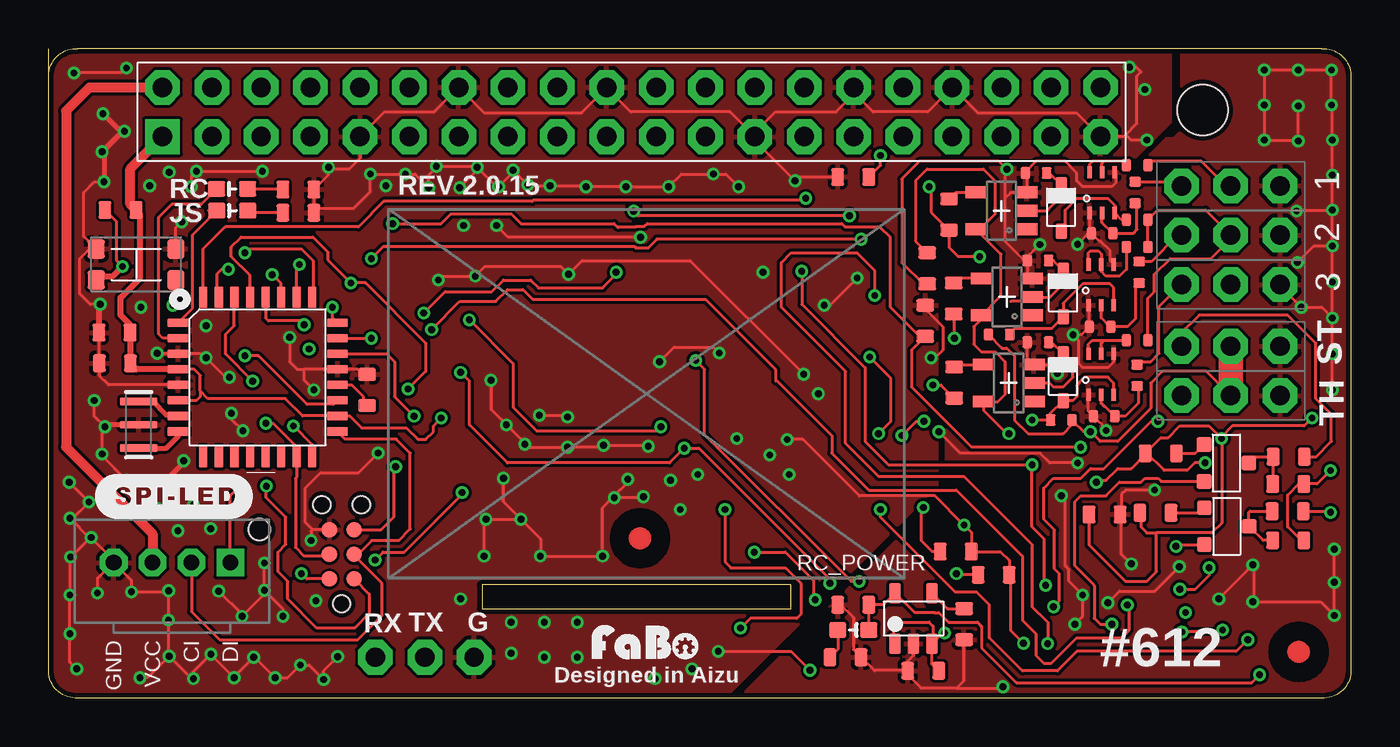
[diagram p9: board, top side]
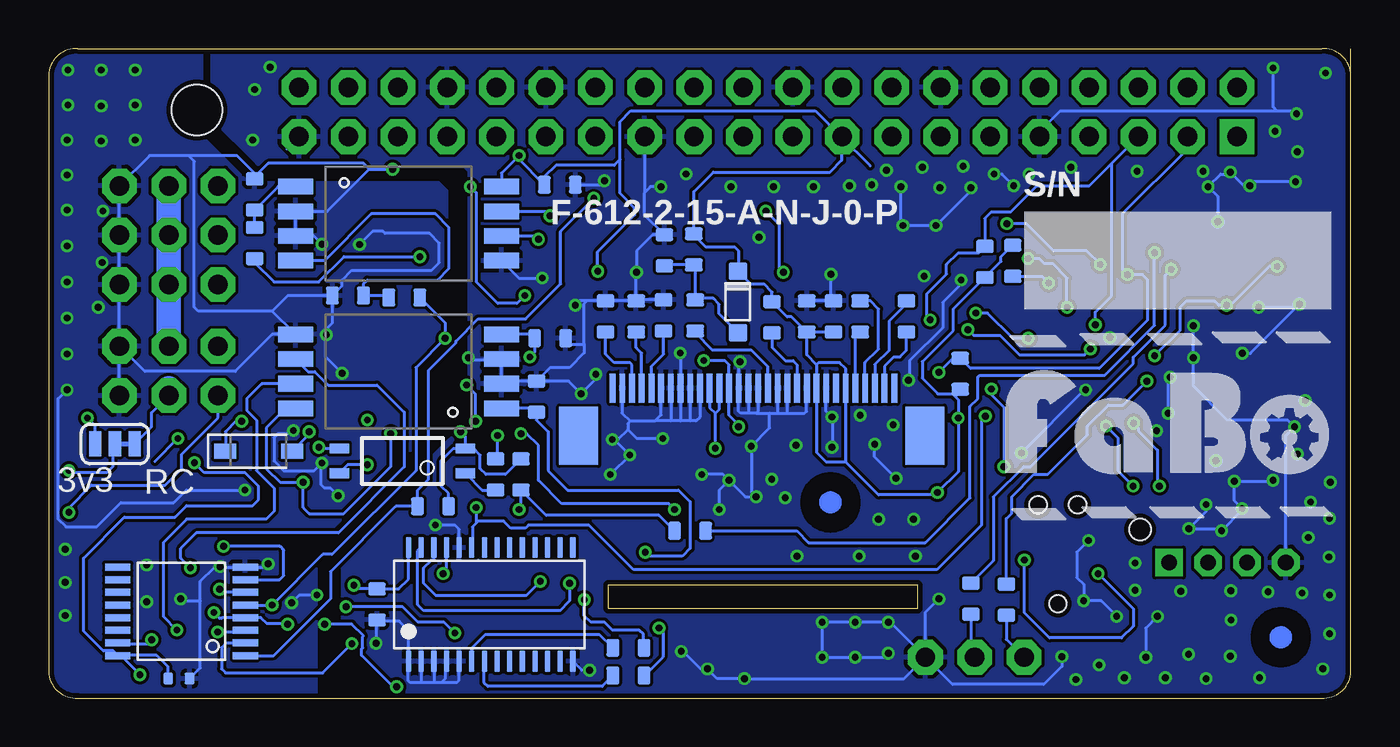
[diagram p10: board, bottom side, seen from below]

Size 67 x 33.4 mm. Coordinates in mm from the lower left corner, seen from the top.
Outline: 0,31.9 0,33.4
Outline: 0,31.9 arc-97 1.5,33.4 65.5,33.4 arc-97 67,31.9 67,1.5 arc-97 65.5,0 1.5,0 arc-97 0,1.5 0,31.9
Outline: 22.3,4.6 38.2,4.6 38.2,5.83 22.3,5.83 22.3,4.6
Copper layers (1*16): Top 0.035mm / dielectric 1.6mm / Bottom 0.035mm
Design rules "PCBway": minimum track width 6mil, minimum drill 12mil, track to track 6mil, track to pad 6mil, pad to pad 6mil, via to via 6mil, smd to smd 6mil, copper to edge 10mil, drill to drill 10mil, minimum pad ring 10mil, minimum via ring 6mil, stop-mask expansion 2mil, vias tented up to drill 100mil, thermal gap 8mil
Holes 2.6 mm at 59.38,30.25
tKeepout: area 17.4,6 to 44.2,25.2
bKeepout: area 3,11.9 to 7,15.6
bRestrict: 7 lines

### Footprints (pad centres in the part's own frame; a part is rotated, then mirrored left to right if it is on the bottom)
FABO_BRICK_3PIN_HEADER = drill 1 pad 1.778 octagon: GND -2.54,0; I/O 2.54,0; VCC 0,0
0603 = smd 0.65 x 0.9: 1 -0.8,0; 2 0.8,0
0402 = smd 0.5 x 0.6: 1 -0.55,0; 2 0.55,0
PIN_1X3 = drill 1 pad 1.778 octagon: 1 -2.54,0; 2 0,0; 3 2.54,0
1N4148W = smd 0.9 x 0.95: ANODE 0,0; CATHODE 3.15,0
SOD-323 = smd 0.8 x 0.6: A -1.2,0; K 1.2,0
SOD3715X135 = smd 1.127 x 0.784: 1 -1.722,0; 2 1.722,0
TQFP-32 = smd 1.1 x 0.45: 1 -4.1,2.8; 2 -4.1,2; 3 -4.1,1.2; 4 -4.1,0.4; 5 -4.1,-0.4; 6 -4.1,-1.2; 7 -4.1,-2; 8 -4.1,-2.8; 17 4.1,-2.8; 18 4.1,-2; 19 4.1,-1.2; 20 4.1,-0.4; 21 4.1,0.4; 22 4.1,1.2; 23 4.1,2; 24 4.1,2.8 | smd 0.45 x 1.1: 9 -2.8,-4.1; 10 -2,-4.1; 11 -1.2,-4.1; 12 -0.4,-4.1; 13 0.4,-4.1; 14 1.2,-4.1; 15 2,-4.1; 16 2.8,-4.1; 25 2.8,4.1; 26 2,4.1; 27 1.2,4.1; 28 0.4,4.1; 29 -0.4,4.1; 30 -1.2,4.1; 31 -2,4.1; 32 -2.8,4.1
JETSON_NANO_NOBOARDER = drill 1 pad 1.778 square: 1 1.27,1.27 | drill 1 pad 1.778 octagon: 2 1.27,3.81; 3 3.81,1.27; 4 3.81,3.81; 5 6.35,1.27; 6 6.35,3.81; 7 8.89,1.27; 8 8.89,3.81; 9 11.43,1.27; 10 11.43,3.81; 11 13.97,1.27; 12 13.97,3.81; 13 16.51,1.27; 14 16.51,3.81; 15 19.05,1.27; 16 19.05,3.81; 17 21.59,1.27; 18 21.59,3.81; 19 24.13,1.27; 20 24.13,3.81; 21 26.67,1.27; 22 26.67,3.81; 23 29.21,1.27; 24 29.21,3.81; 25 31.75,1.27; 26 31.75,3.81; 27 34.29,1.27; 28 34.29,3.81; 29 36.83,1.27; 30 36.83,3.81; 31 39.37,1.27; 32 39.37,3.81; 33 41.91,1.27; 34 41.91,3.81; 35 44.45,1.27; 36 44.45,3.81; 37 46.99,1.27; 38 46.99,3.81; 39 49.53,1.27; 40 49.53,3.81
TSSOP-16 = smd 0.36 x 1.3: 1 -2.275,-3.28; 2 -1.625,-3.28; 3 -0.975,-3.28; 4 -0.325,-3.28; 5 0.325,-3.28; 6 0.975,-3.28; 7 1.625,-3.28; 8 2.275,-3.28; 9 2.275,3.28; 10 1.625,3.28; 11 0.975,3.28; 12 0.325,3.28; 13 -0.325,3.28; 14 -0.975,3.28; 15 -1.625,3.28; 16 -2.275,3.28
PCA9685 = smd 0.3 x 1.1: 1 -4.15,-2.93; 2 -3.5,-2.93; 3 -2.85,-2.93; 4 -2.2,-2.93; 5 -1.55,-2.93; 6 -0.9,-2.93; 7 -0.25,-2.93; 8 0.4,-2.93; 9 1.05,-2.93; 10 1.7,-2.93; 11 2.35,-2.93; 12 3,-2.93; 13 3.65,-2.93; 14 4.3,-2.93; 15 4.3,2.92; 16 3.65,2.92; 17 3,2.92; 18 2.35,2.92; 19 1.7,2.92; 20 1.05,2.92; 21 0.4,2.92; 22 -0.25,2.92; 23 -0.9,2.92; 24 -1.55,2.92; 25 -2.2,2.92; 26 -2.85,2.92; 27 -3.5,2.92; 28 -4.15,2.92
SOT-23-5 = smd 0.6 x 1.05: 1 -0.95,-1.3; 2 0,-1.3; 3 0.95,-1.3; 4 0.95,1.3; 5 -0.95,1.3
TC2030 = smd 0.787 x 0.787: 1 1.27,-0.635; 2 1.27,0.635; 3 2.54,-0.635; 4 2.54,0.635; 5 3.81,-0.635; 6 3.81,0.635 | hole 0.889: 0,0; 5.08,-1.016; 5.08,1.016
0603' = smd 0.9 x 0.8: ANODE -0.8,0; CATHODE 0.8,0
SMT-JUMPER_3_1-NC_TRACE_SILK = smd 0.635 x 1.27: 1 -1.016,0; 2 0,0; 3 1.016,0
SUPERSOT-3 = smd 0.76 x 0.76: D 0,1.15; G -0.95,-1.15; S 0.95,-1.15
SPI-B04B-PASK-1 = drill 0.8 pad 1.422 octagon: CI 1,1.27; GND -3,1.27; VCC -1,1.27 | drill 0.8 pad 1.422 square: DI 3,1.27 | hole 1.1: 4.5,2.97
KMR2 = smd 0.9 x 1: 1 -2.05,0.8; 2 2.05,0.8; 3 2.05,-0.8; 4 -2.05,-0.8
ER-CON30HT-1 = smd 0.3 x 1.5 bottom: 1 7,-0.23; 2 6.5,-0.23; 3 6,-0.23; 4 5.5,-0.23; 5 5,-0.23; 6 4.5,-0.23; 7 4,-0.23; 8 3.5,-0.23; 9 3,-0.23; 10 2.5,-0.23; 11 2,-0.23; 12 1.5,-0.23; 13 1,-0.23; 14 0.5,-0.23; 15 0,-0.23; 16 -0.5,-0.23; 17 -1,-0.23; 18 -1.5,-0.23; 19 -2,-0.23; 20 -2.5,-0.23; 21 -3,-0.23; 22 -3.5,-0.23; 23 -4,-0.23; 24 -4.5,-0.23; 25 -5,-0.23; 26 -5.5,-0.23; 27 -6,-0.23; 28 -6.5,-0.23; 29 -7,-0.23; 30 -7.5,-0.23 | smd 2 x 3 bottom: 31 -9.07,-2.67; 32 8.74,-2.67
11-3C1 = smd 1 x 0.5: 1 -3.24,0.635; 2 -3.24,-0.635; 3 3.24,-0.635; 4 3.24,0.635
TLP2270 = smd 0.8 x 1.8: 1 -1.905,-5.3; 2 -0.635,-5.3; 3 0.635,-5.3; 4 1.905,-5.3; 5 1.905,5.3; 6 0.635,5.3; 7 -0.635,5.3; 8 -1.905,5.3
US6 = smd 0.3 x 0.635: 1 -0.65,-1.05; 2 0,-1.05; 3 0.65,-1.05; 4 0.65,1.05; 5 0,1.05; 6 -0.65,1.05
SOT-23 = smd 1.1 x 0.6: 1 -1.3,0.95; 2 -1.3,0; 3 -1.3,-0.95; 4 1.3,-0.95; 5 1.3,0.95
CSTNE_V_C = smd 0.4 x 1.9: 1 1.2,0; 2 0,0; 3 -1.2,0

### Placement (x,y rotation side)
1  60.82,26.35 180 top
2  60.82,23.81 180 top
3  60.82,21.27 180 top
C1  16.39,15.85 270 top
C2  50.11,4.82 90 bottom
C3  3.41,17.22 0 top
C4  25.25,19.63 90 bottom
C5  22.87,19.63 270 bottom
C6  28,19.63 270 bottom
C7  26.62,19.63 270 bottom
C8  38.35,19.63 270 bottom
C9  36.77,19.63 270 bottom
C10  45,1.4 0 top
C11  35.32,23.03 270 bottom
C12  3.39,18.8 0 top
C13  60.3,1 180 bottom
C16  41.4,26.8 0 top
C17  45.2,22.1 90 top
C18  40.7,26.4 180 bottom
C22  41.4,4.8 0 top
C23  47.1,3.8 90 top
C24  54.33,9.45 180 top
CN1  19.35,2.1 0 top
D1  31.54,18.8 90 bottom
D2  52.2,16.5 90 top
D3  52.1,25.2 90 top
D5  56.2,12.7 0 bottom
D6  52.2,20.8 90 top
IC1  10.76,16.51 0 top
IC2  4.59,27.6 0 top
IC3  60.16,4.46 90 bottom
IC4  44.33,4.82 0 bottom
IC5  44.5,4.1 0 top
ICSP1  15.08,4.86 90 top
JETSON  GREEN  [0603']  9.44,26.19 0 top
JETSON1  RED  [0603']  9.45,25.07 0 top
JP2  63.59,13.08 0 bottom
Q1  60.6,12.09 270 top
Q2  60.61,8.84 270 top
R1  48.62,6.34 180 top
R2  17.4,22.49 90 bottom
R3  46.67,7.54 180 top
R4  56,27.4 0 top
R5  12.85,24.96 180 top
R6  56,24.6 0 top
R7  18.83,22.43 90 bottom
R8  33.73,19.68 270 bottom
R9  20.11,16.68 90 bottom
R10  12.85,26.16 180 top
R11  56.95,9.54 180 top
R12  17.73,5.06 90 bottom
R13  19.55,5.11 90 bottom
R14  63.78,8.11 0 top
R15  56,23.2 0 top
R16  47.23,9.86 180 bottom
R17  63.8,12.41 180 top
R18  57.22,12.59 180 top
R19  63.78,11.01 0 top
R20  63.75,9.61 180 top
R21  48.9,18.7 180 top
R22  29.78,19.58 270 bottom
R23  33.81,23.08 270 bottom
R24  50.9,22.5 0 top
R25  46.57,20.55 270 top
R26  52.1,14.3 0 top
R27  50.8,27 0 top
R28  55.9,26 270 top
R29  46.33,24.87 270 top
R30  56.1,21.9 270 top
R31  50.9,18.3 0 top
R32  46.59,16.23 270 top
R33  37.17,2.58 180 bottom
R34  37.17,1.16 180 bottom
R35  35.36,19.68 90 bottom
R37  56,16.6 270 top
R38  54.2,23.9 0 top
R39  54.3,14.5 0 top
R40  54.1,19.1 0 top
R41  3.7,25.1 0 top
R42  41,2.1 180 top
R43  56.4,23.4 270 bottom
R44  48.7,20.6 0 bottom
R45  44,11.5 90 bottom
R46  45.1,19.4 270 top
R47  41.9,15.5 90 bottom
R48  41.2,18.5 0 bottom
R49  56.4,25.9 270 bottom
R50  51.6,20.7 0 bottom
R51  42.7,11.5 270 bottom
R52  34,8.6 0 bottom
R53  56,18.4 0 top
RC_POWER  YELLOW  [0603']  41.4,3.5 180 top
SPI-LED  6.35,5.7 0 top
ST  60.82,18.1 180 top
SW1  4.5,22.3 0 top
TH  60.82,15.56 180 top
U1  30.99,16.16 0 top
U7  48.8,12.2 180 bottom
U$1  [MARK_POINT_3MM]  64.32,2.38 270 top
U$2  [MARK_POINT_3MM]  3.61,3.13 90 bottom
U$3  [MARK_POINT_3MM]  26.78,10.07 0 bottom
U$4  [LOGO_FABO_L_BOTTOM]  9.3,11.1 0 top
U$5  49,16.8 90 bottom
U$6  [MARK_POINT_3MM]  30.43,8.22 0 top
U$8  49,24.4 270 bottom
U$9  54.2,26 0 top
U$11  54.15,21.25 0 top
U$14  49.03,25.06 180 top
U$20  49.31,20.64 180 top
U$21  54.15,16.65 0 top
U$23  49.4,16.21 180 top
U$24  [LOGO_FABO_S]  30.75,1.85 0 top
X2  4.64,14.06 90 top

### Tracks (layer width: path | path; a pad name or v marks a point on that pad's centre or on a via)
3V3  (via drill 0.35)
  Top 0.152: IC1.18 14.94,14.59 | IC1.18 14.76,14.61 | v38.75,21.95 38.75,20.25 42,17 42,13.2 43.2,12 v50.6,12 50.6,8.8 51.2,8.2 51.2,5.9 v51.3,5.8 | IC1.6 7.6,15.3 7.8,15.5 7.8,15.8 | 7.8,15.8 7.8,16.6 7.49,16.91 IC1.4 | IC1.18 13.07,14.51 12.18,15.4 9.74,15.4 9.73,15.41 8.2,15.41 7.8,15.8 | IC1.18 15.49,14.51 16.1,13.9 18.4,13.9 19,13.3 19.4,13.3 19.8,13.7 19.8,14 v20.2,14.4 | ICSP1.2 13.28,6.13 v13,6.4 | v16.8,7.1 17.2,7.5 18.3,7.5 21.28,10.48 v21.28,10.58 | C16.2 42.8,27.4 v42.8,27.9
  Top 0.305: C12.2 4.19,17.24 C3.2 4.52,16.91 IC1.4 | 4.19,19.03 C12.2 | C12.2 4.19,19.21 3.7,19.7 3.7,20.6 4.7,21.6 4.7,24.9 R41.2
  Top 0.508: R41.2 4.2,25.4 4.2,27.22 IC2.1
  Bottom 0.152: 20.35,15.5 20.5,15.65 21.25,15.65 22.05,16.45 22.05,17.3 20.45,18.9 20.45,20.01 R7.1 18,22.46 18,22.7 17.5,23.2 17.4,23.2 | 20.35,15.5 20.2,15.35 v20.2,14.4 20.2,11.65 v21.28,10.58 21.4,10.45 24.3,10.45 25.99,12.14 25.99,12.15 | 25.99,12.15 U1.25 25.99,16.94 26.3,17.25 27.38,17.25 27.49,17.14 | 25.99,12.15 27,12.15 27.49,12.64 U1.22 27.49,17.14 | R9.1 20.11,15.75 20.35,15.5 | IC2.17 26.2,28.85 | 26.2,28.85 | 26.2,28.85 26.2,27.65 26.8,27.05 32.8,27.05 33.81,26.05 R23.1 33.81,23.81 33.2,23.2 31.7,23.2 31.5,23 31.5,21.99 D1.CATHODE 30.89,21.3 30.2,21.3 29.78,20.88 R22.1 29,19.6 28.77,19.6 C6.2 | 24.73,27.37 26.2,28.85 | v38.75,21.95 38.75,22.95 36.85,24.85 36.85,25.2 37.6,25.95 37.6,27.7 | 37.6,27.7 37.6,29.65 37.05,30.2 27.55,30.2 26.2,28.85 | 43.61,26.4 U$8.8 43.7,27 v42.8,27.9 42.8,27.7 C18.2 | v50.6,12 51.61,12 U7.4 | C18.2 41.55,26.45 | 37.6,27.7 37.9,27.4 40.9,27.4 41.5,26.8 C18.2 | IC4.28 48.48,6.12 48.99,5.62 C2.2 51.12,5.62 v51.3,5.8 | 17.4,23.07 17.4,23.2 | 17.4,23.2 R2.2 | v13,6.4 11.2,4.6 11.2,3.7 11.8,3.1 15.5,3.1 16.8,4.4 v16.8,7.1 | C7.2 C6.2 | C6.2 28,17.65 27.49,17.14
5V
  Top 0.508: IC2.2 5.85,31.4 2.1,31.4 0.9,30.2 0.9,12.9 5.35,8.45 SPI-LED.VCC
AVR_MISO  (via drill 0.35)
  Top 0.152: ICSP1.1 16.5,5.34 16.5,4.35 15.75,3.6 13.8,3.6 12.3,5.1 12.3,6 11.8,6.5 11.8,7.5 12.2,7.9 12.2,9.3 11.2,10.3 v11.2,10.9 | v12.6,14 13.56,13.03 IC1.16
  Bottom 0.152: v12.6,14 11.98,13.38 11.98,11.68 v11.2,10.9
AVR_MOSI  (via drill 0.35)
  Top 0.152: ICSP1.4 14.35,7.3 13.16,7.3 12.7,7.75 12.7,11.3 12.76,11.36 IC1.15 12.76,12.92 11.55,14.13 v11.18,14.13 | SPI-LED.DI 9.35,10.4 v9.85,10.9
  Bottom 0.152: v9.85,10.9 9.85,11 9.95,11.1 9.95,12.75 10.93,13.73 10.93,13.88 v11.18,14.13
AVR_RESET  (via drill 0.35)
  Top 0.152: ICSP1.5 17.12,8.67 17.75,9.3 17.75,11.8 v17.85,11.9 | v18.5,15.9 19.4,16.8 19.4,18.25 16.3,21.35 v15.55,21.35 14.36,22.55 14.36,22.95 13.6,23.7 9.9,23.7 9.4,23.2 9.4,22.7 10.36,21.74 IC1.29
  Bottom 0.152: v18.5,15.9 18.5,15.6 17.85,14.95 v17.85,11.9 | R2.1 15.89,21.69 v15.55,21.35
AVR_RX  (via drill 0.35)
  Top 0.152: IC1.30 9.55,20.6 9.55,19.15 9.1,18.7 9.1,17.7 v10.5,16.3
  Bottom 0.152: R12.2 17.73,9.23 17.45,9.5 17.45,10.35 16.3,11.5 15.6,11.5 13.56,13.55 13.56,13.99 12.49,15.06 11.74,15.06 v10.5,16.3
AVR_SCK
  Top 0.152: IC1.17 15.25,13.32 17.88,13.32 18.6,12.6 18.6,8.7 18,8.1 16.62,8.1 15.92,7.4 ICSP1.3 15.72,7.34 17.15,5.9 17.15,4.25 15.9,3 8.8,3 7.35,4.45 SPI-LED.CI
AVR_TX  (via drill 0.35)
  Top 0.152: v9.25,22.05 8.9,22.05 8.65,21.8 8.65,20.72 IC1.31
  Bottom 0.152: v9.25,22.05 9.55,21.75 9.55,19.19 11.2,17.54 11.2,17.2 16.5,11.9 16.84,11.9 18.4,10.34 18.4,7.07 R13.2
CH1  (via drill 0.35)
  Top 0.152: v47.9,22.7 46.8,22.7 46.33,23.18 R29.2 45.4,24.99 45.4,26.2 v45.3,26.3 | v42.5,20.7 42.5,22 41.6,22.9 38.2,22.9 37.7,22.4 37.7,20.1 41,16.8 41,13.1 42.7,11.4 47.1,11.4 50.6,7.9 50.6,4.7 51.4,3.9 v51.4,2.8
  Bottom 0.152: R43.2 56.4,22.4 55.4,21.4 53.1,21.4 51.8,22.7 v47.9,22.7 | v42.5,20.7 42.9,20.3 43.9,20.3 45,21.4 45,26 v45.3,26.3 | IC3.2 57.87,2.84 58.1,2.6 58.1,1.5 57.9,1.3 52.9,1.3 v51.4,2.8
CH2  (via drill 0.35)
  Top 0.152: v19.7,18.95 21.15,20.4 23,20.4 23.6,21 24.4,21 24.9,20.5 33.8,20.5 37.4,16.9 37.4,16.4 | v46.6,18.5 46.6,19.72 R25.2 | 37.4,16.4 37.4,16.3 | 37.4,16.4 40.3,13.5 40.3,12.6 42.2,10.7 46.7,10.7 50.1,7.3 50.1,4 50.8,3.3 50.8,2.2 51.2,1.8 51.6,1.8 52.9,3.1 55.2,3.1 55.6,3.5 55.6,4.69 v55.5,4.79
  Bottom 0.152: v19.7,18.95 19.4,18.65 18.05,18.65 17.05,17.65 13.7,17.65 v13.4,17.95 | R44.2 46.6,19.3 v46.6,18.5 48.1,17 48.1,11.7 52.42,7.39 52.9,7.39 v55.5,4.79 IC3.5
CH3  (via drill 0.35)
  Top 0.152: 46.38,15.43 R32.2 45.91,16.1 v45.5,16.1 | v43.9,13.5 44.64,14.24 v45.04,14.24
  Bottom 0.152: R45.2 43.9,12.4 v43.9,13.5 | v45.04,14.24 45.04,15.64 v45.5,16.1
D3
  Top 0.152: 8.22,25.07 JETSON1.ANODE 7.4,23.82 7.4,20.05 IC1.1
D4
  Top 0.152: 6.26,18.51 IC1.2 5.88,18.51 5.68,18.71 5.68,24.73 6.34,25.39 7.84,25.39 JETSON.ANODE
EN  (via drill 0.35)
  Top 0.152: v10.1,22.9 10.3,23.1 13,23.1 13.6,22.5 13.6,20.65 IC1.25
  Bottom 0.152: R52.2 28.5,8.6 27.9,8 21.9,8 19.6,10.3 19.6,15 19.2,15.4 19.2,16.5 19.1,16.6 12.67,16.6 10.1,19.17 v10.1,22.9
GND  (via drill 0.35)
  Top 0.152: 6.51,15.96 IC1.5 3.09,16.11 2.64,16.56 2.64,17.26 C3.1 | 2.51,17.22 C3.1 | 41.42,30.77 41.42,31.05 | 41.42,31.05 41.42,31.15 | 41.42,31.15 IC2.30 | 41.42,31.15 42.42,30.15 45.24,30.15 IC2.34 47.81,30.1 52.89,30.1 54.02,28.97 | v30.85,12.95 30.8,13 v28.55,13 28.45,12.9 v26.7,12.9 24.65,12.9 v24.5,13.05 24.5,13.1 v23.55,14.05 22.76,14.85 v22.76,16.35 | C12.1 2.69,18.7 2.61,18.63 C3.1 | v5.59,17.73 5.61,17.71 IC1.3 7.8,17.7 8,17.5 v8.1,17.5 9.1,16.5 v9.3,16.5 | 54.02,28.97 IC2.39 54.15,28.9 55.35,28.9 55.43,28.98 | IC2.25 36.34,29.09 37.4,30.15 40.52,30.15 41.42,31.05 | IC2.25 35.06,30.15 29.95,30.15 28.72,31.39 | 28.72,31.39 IC2.20 | 28.72,31.39 27.43,30.1 22.41,30.1 IC2.14 19.84,30.15 17.3,30.15 IC2.9 16.02,27.77 15.45,27.2 14.4,27.2 | 13.15,16.91 IC1.21 15.89,16.91 16.16,16.65 C1.1 | v31.44,17.3 32.19,18.05 34.2,18.05 v34.5,17.75 | 35.64,13.35 v35.4,13.35 | ICSP1.6 13.59,8.67 | v16.95,12.6 15.95,11.6 14,11.6 13.2,10.8 13.2,9.05 13.59,8.67 | v13.65,15.85 13.15,16.35 13.15,16.91 | 54.62,28.97 54.02,28.97 | 55.43,28.98 56,29.55 56,31.2 | 56,31.2 56,32 56.2,32.2 55.95,32.45 v55.6,32.45 | v25.25,14.55 26.6,14.55 v26.7,14.45 | v19.95,27.35 20,27.35 | 20,27.35 22,27.35 v22.05,27.3 22.23,27.13 | 22.23,27.13 23.05,26.3 v23.15,26.3 23.9,27.05 v23.9,27.15 v24.65,26.4 24.7,26.35 v25.8,26.35 27.6,26.35 v27.65,26.3 v29.7,26.3 v31.9,26.3 32.55,26.95 v34.2,26.95 34.85,26.95 v35.5,26.3 | v1.45,1.5 1.1,1.86 v1.1,3.31 v1.1,5.3 1.1,7.22 v1.13,7.25 2.14,8.26 v2.19,8.26 | v2.19,8.26 2.1,8.26 v1.1,9.25 1.25,9.25 v2.08,10.08 v1.06,11.1 | v2.19,8.26 3.35,7.1 3.35,7 | 3.35,7 SPI-LED.GND 4.26,6.06 v4.26,5.46 6.11,5.46 v6.18,5.52 v6.16,5.51 v6.16,4.02 6.16,2.19 v6.2,2.15
  Top 0.152: v2.52,5.4 2.52,6.17 3.35,7 | v6.2,2.15 5.1,1.05 v4.7,1.05 | v6.2,2.15 7.35,1 v7.45,1 7.45,1.35 v8.35,2.25 v9.55,1.05 9.55,1.1 v10.55,2.1 10.6,2.1 v11.65,1.05 12.3,1.05 v12.95,1.7 13.4,1.7 v14.15,0.95 14.15,1.42 v14.87,2.13 | v8.75,5.5 9.95,4.3 v9.95,4.2 11.1,5.35 v11.1,5.55 | v11.1,5.55 12.05,4.6 v12.05,4.2 | v4,11.2 2.75,12.45 v2.75,12.55 2.75,13.75 2.93,13.93 v2.9,13.95 2.35,14.5 v2.35,15.3 | v4,32.4 3.75,32.15 v1.3,32.15 | 29.05,10.35 v29.1,10.3 30.55,10.3 v30.6,10.35 | v56.5,28.7 55.7,28.7 55.43,28.98 | v56.4,31.3 56.1,31.3 56,31.2 | 20,27.35 19.55,26.9 v19.55,26.25 18.85,26.95 v18.35,26.95 v16.55,26.95 16.55,26.05 15.7,25.2 13.89,25.2 R5.1 R10.1 14.4,26.91 14.4,27.2 | v21.15,26.25 22.03,27.13 22.23,27.13 | v30.45,23.7 23.65,23.7 v23.05,24.3 | v10,13.75 9.4,14.35 v9.4,14.65 | SW1.1 2.28,23.28 | 2.28,23.28 1.8,23.75 1.8,26 2.35,26.55 v2.85,26.55 | v12.4,18.55 12.4,17.3 12.79,16.91 13.15,16.91 | 13.59,8.67 13.5,8.58 v13.5,8.1 | v11.1,5.55 v11.1,6.95 | v29.8,11.25 29.8,11.1 29.05,10.35 | v20.05,21.5 20.25,21.7 v21.95,21.7 22.45,22.2 26.35,22.2 v26.75,21.8 27.45,22.5 33,22.5 v38.85,16.65 | v41.6,21.6 40.2,20.2 v39.9,20.2 | IC2.25 36.34,28.67 v38.41,26.6 38.61,26.8 C16.1 | v50.16,2.82 49.5,3.47 49.5,6.26 R1.1 49.42,7.08 48.97,7.54 R3.1 47.47,8.53 v47.1,8.9 45.61,10.4 41.71,10.4 38.8,13.3 v38,13.3 | R46.1 45.1,20 46,19.1 46,17.9 45.6,17.5 v45.4,17.5 | v34.45,2.4 38.21,2.4 v39.18,1.43 | v2.65,20.25 2.15,20.25 1.6,20.8 1.6,22.6 2.28,23.28 | 14.4,27.2 v14.4,27.3 | v11,27.1 v7.6,27.1 7.35,26.85 v7.35,26.3 | SW1.2 6.55,24.2 v6.85,24.5 | v22.4,7.3 22.4,9.1 v22.5,9.2 v24.3,9.2
  Top 0.152: v24.3,9.2 23.4,10.1 v23.4,11.3 | v24.3,9.2 25.3,8.2 v25.3,7.3 v28.5,7.3 28.5,9.8 29.05,10.35
  Top 0.254: X2.2 3.01,14.06 v2.9,13.95 | v6,11.15 6.95,12.1 v6.95,12.2 | v2.8,30.05 3.7,29.15 v3.9,29.15 3.8,29.15 v2.75,28.1 2.85,28 v2.85,26.55
  Top 0.305: C12.1 2.59,20.19 v2.65,20.25
  Bottom 0.152: U1.2 37.5,14.65 37.1,14.25 37.05,14.25 | U1.6 35.49,14.56 35.8,14.25 | 37.05,14.25 35.8,14.25 | U1.10 33.5,14.45 33.7,14.25 34,14.25 | 34,14.25 34.5,14.25 | 34.5,14.25 35,14.25 | 35,14.25 35.8,14.25 | U1.7 34.99,14.26 35,14.25 | 34.5,14.25 34.49,14.26 U1.8 v34.5,17.75 | U1.9 33.99,14.26 34,14.25 | 30.6,14.65 31,14.65 | 30.6,14.65 30.49,14.76 U1.16 | U1.15 30.99,14.66 31,14.65 | 30.6,14.65 29.9,14.65 | 29.9,14.65 29.5,14.65 | 29.5,14.65 29,14.65 | 29,14.65 28.1,14.65 28,14.75 U1.21 | U1.18 29.5,14.65 | U1.19 29,14.65 | U1.23 27,14.75 v26.7,14.45 26.65,14.4 26.65,13.15 26.7,13.1 v26.7,12.9 | IC2.25 36.34,26 | 36.34,26 36.34,24.81 36.31,24.81 C11.1 35.93,23.83 36.75,23 v36.75,21.9 36.77,21.88 C9.1 | SPI-LED.GND 3.35,13.5 v2.9,13.95 3.25,14.3 6.35,14.3 8.1,16.05 v8.1,17.5 v8.1,19.15 | v5.59,17.73 5.17,17.73 2.8,20.1 | 2.8,20.1 v2.65,20.25 | 54.75,28.24 IC2.39 | 31,14.65 31.4,14.65 31.5,14.75 U1.14 31.49,17.25 v31.44,17.3 | 37.05,14.25 37.2,14.1 37.2,13.8 | 39.45,18.2 39.45,17.76 40.21,17 41.2,17 R47.2 | IC4.3 47.18,0.82 47.2,0.8 | IC4.4 46.6,1.82 46.6,1 46.8,0.8 | IC4.2 47.83,0.83 47.8,0.8 | IC4.5 45.9,1.87 45.9,0.9 46,0.8 46.8,0.8 | IC2.9 16.02,29.14 14.95,30.2 3.8,30.2 | 29.9,14.65 29.9,13.9 v30.85,12.95 30.85,10.6 v30.6,10.35 31.15,10.35 v32,11.2 | v16.95,12.6 13.7,15.85 v13.65,15.85 | v20.05,21.5 20.05,21.3 21,20.35 21,19.05 22.7,17.35 22.7,16.41 v22.76,16.35 | v4.75,20.1 2.8,20.1 | v2.85,26.55 5,26.55 v5.2,26.35 5.5,26.35 v6.2,27.05 6.3,26.95 6.7,26.95 v7.35,26.3 6.85,25.8 v6.85,24.5 | v35.5,26.3 36.04,26.3 36.34,26 | v9.95,4.2 10.55,3.6 v10.55,2.1 | v12.05,4.2 12.85,5 v13.75,5 13.75,5.85 14.1,6.2 14.1,7.5 v13.5,8.1
  Bottom 0.152: v11.1,5.55 11.15,5.55 | v7.45,9.95 7.45,9.6 v8.34,8.72 6.77,8.72 v6.65,8.6 5.6,9.65 v5.6,9.75 6,10.15 v6,11.15 4.05,11.15 v4,11.2 | v4,32.4 4,30.4 3.8,30.2 | v34.45,2.4 34.4,2.35 34.3,2.35 33.45,1.5 v33.1,1.5 32.6,1 v31.2,1 22.99,1 CN1.3 | v23.15,26.3 23.15,24.4 v23.05,24.3 v21.35,24.3 19.55,26.1 v19.55,26.25 | v9.4,14.65 9.4,16.4 v9.3,16.5 | v38.85,16.65 38.85,16.4 v39.6,15.65 40.25,16.3 R47.2 | v17.35,26.35 17.95,26.95 v18.35,26.95 | v14.87,2.13 14.87,1.64 15.8,0.7 20.49,0.7 CN1.3 | v2.8,30.05 2.95,30.2 3.8,30.2 | R47.2 43.57,16.3 U$5.2 43.7,17.4 | R48.2 40.1,18.2 39.45,18.2 | v35.4,13.35 36.75,13.35 37.2,13.8 | U$8.5 42.81,21.6 v41.6,21.6 | 43.7,17.4 U$5.3 | C18.1 38.61,26.4 v38.41,26.6 | C2.1 50.16,3.96 | 50.16,3.96 v50.16,2.82 | IC4.24 45.88,8.68 46.1,8.9 v47.1,8.9 | 46.8,0.8 47.2,0.8 | 47.2,0.8 47.8,0.8 | 47.8,0.8 48.4,0.8 48.5,0.9 48.5,1.87 IC4.1 48.48,3.48 48.96,3.96 50.16,3.96 | v45.4,17.5 45.3,17.4 43.7,17.4 | v39.18,1.43 39.57,1.43 IC4.14 | v38,13.3 37.9,13.3 | 37.9,13.3 37.7,13.3 37.2,13.8 | R35.2 36.72,20.48 C9.1 | C9.1 C8.1 39.3,20.43 | v26.75,21.8 26.75,20.56 C7.1 C6.1 | 39.3,20.43 39.68,20.43 v39.9,20.2 | 39.3,20.43 39.45,20.28 39.45,18.2 | CN1.3 23.69,3.9 v23.8,3.9 v25.5,3.9 v27.2,3.9 v27.2,2.1 v25.5,2.1 24,2.1 v23.8,2.3 | CN1.3 21.89,4.41 v21.2,5.1 | v23.4,11.3 24.5,12.4 v24.5,13.05 | v32,11.2 32.3,11.5 v33.4,11.5 | v32,11.2 32.5,10.7 v32.5,9.7 | v38.1,11.5 v37.1,12.5 37.9,13.3
  pour Top (rank 6): -6.9,-4.6 -6.9,40 -2.8,44.1 51.3,44.1 57.7,37.7 57.7,29.6 55.9,27.8 46.4,27.8 45.7,27.1 45.7,10.9 30.2,-4.6
  pour Bottom (rank 6): -8.3,-5.9 -8.3,40.4 -3.3,45.4 51,45.4 58.6,37.8 58.6,29.8 56.3,27.5 56.2,27.4 45.7,27.4 45.4,27.1 45.4,14.3 47.4,12.3 51.9,7.8 51.9,-0.7 46.7,-5.9
J_CH1  (via drill 0.35)
  Top 0.152: v60.4,3.5 60.3,3.4 v58.3,3.4
  Bottom 0.152: U$5.7 56.04,16.17 56.8,15.4 56.8,14.8 56.3,14.3 56.3,11.7 55.4,10.8 55.4,9.6 55.8,9.2 59.9,9.2 61.1,8 61.1,4.2 v60.4,3.5 | v58.3,3.4 56.97,3.4 IC3.3
J_CH2  (via drill 0.35)
  Top 0.152: v59.7,6.7 59.7,6.3 59,5.6 v58.2,5.6
  Bottom 0.152: U$5.6 53.66,16.8 53.31,16.8 52.61,16.1 50.1,16.1 48.7,14.7 48.7,11.89 52.09,8.5 59.4,8.5 60.2,7.7 60.2,7.2 v59.7,6.7 | IC3.6 58.04,5.44 v58.2,5.6
N$2
  Top 0.152: U$9.2 54.2,24.45 R38.2 55.8,23.9 56,24.1 56,25.35 R28.2
N$3
  Top 0.152: 61.88,12.09 Q1.D 62.07,12.41 R17.2 63,11.04 R19.1
N$4
  Top 0.152: IC1.20 14.88,16.1 15.61,16.1 16.2,15.5 16.2,15.24 C1.2
N$5
  Top 0.152: X2.3 4.73,12.95 | 6.33,13.57 6.55,13.57 6.69,13.71 IC1.8
  Top 0.254: X2.3 6.06,12.86 6.69,13.49 6.69,13.71
N$6
  Bottom 0.152: R12.1 17.73,3.02 CN1.1
N$7  (via drill 0.35)
  Top 0.152: IC1.19 14.66,15.11 13.29,15.11 10.8,17.6 v10.1,17.6 | SW1.3 6.4,21.35 v6.4,20.2 | v3.8,22.2 3.5,22.5 3.5,24.5 R41.1
  Top 0.305: SW1.4 2.65,21.7 3.3,21.7 v3.8,22.2
  Bottom 0.152: v10.1,17.6 8.8,18.9 8.8,20.1 8.5,20.4 7,20.4 6.8,20.2 v6.4,20.2 6.2,20.2 4.2,22.2 v3.8,22.2
N$8  (via drill 0.35)
  Top 0.152: R1.2 46.77,6.34 v46.7,6.4
  Bottom 0.152: v46.7,6.4 46.53,6.57 IC4.25
N$9
  Top 0.152: R14.1 62.49,8.11 Q2.D 61.76,9.56 61.81,9.61 R20.2
N$10
  Top 0.152: ST.I/O 58.28,18.78 59.2,19.7 63.75,19.7 65.2,18.25 65.2,15.4 66,14.6 66,13.2 65.21,12.41 R17.1
N$11
  Top 0.152: U$11.2 54.15,19.55 54.6,19.1 R40.2 55.5,19.1 55.9,19.5 55.9,21.15 R30.2
N$12
  Top 0.152: D3.A 52.3,24.2 52.3,25.1 52.9,25.7 54.5,25.7 54.85,25.35 U$9.3 55.2,24.6 R6.1
N$13
  Top 0.152: 2.I/O 58.08,23.81 56.73,22.45 R30.1
N$14  (via drill 0.35)
  Top 0.152: R20.1 65.89,9.61 v65.95,9.55
  Bottom 0.152: v65.95,9.55 65.95,9.8 64.8,10.95 61,10.95 60.15,11.8 60.15,12.55 58.28,14.42 TH.I/O
N$15
  Top 0.152: 6.6,14.57 IC1.7 | 5.3,15.26 X2.1
  Top 0.254: X2.1 5.35,15.26 6.03,14.57 6.6,14.57
N$16
  Bottom 0.152: U1.27 24.99,17.26 24.3,17.95 24.3,20 24.73,20.43 C4.2
N$17
  Bottom 0.152: 19.55,4.28 R13.1 19.55,2.3 CN1.2
N$18
  Top 0.152: U$11.6 53.5,22.9 53.6,23 54,23 54.15,22.85 U$11.5 54.15,21.95 54.4,21.7 55.1,21.7 55.45,22.05 R15.1
N$19
  Top 0.152: R5.2 10.36,24.96 JETSON1.CATHODE
N$20
  Top 0.152: JETSON.CATHODE 12.03,26.19 R10.2
N$21
  Bottom 0.152: U1.26 25.49,18.58 C4.1
N$22
  Bottom 0.152: C5.1 22.87,20.28 23.75,19.4 23.75,17.9 24.49,17.16 U1.28
N$23
  Bottom 0.152: U1.29 23.99,17.06 23.5,17.55 23.2,17.55 22.87,17.88 C5.2
N$24
  Bottom 0.152: U1.5 35.99,17.06 35.36,17.69 R35.1
N$25
  Bottom 0.152: U1.4 36.49,17.74 36.77,18.02 C9.2
N$26
  Bottom 0.152: U1.3 36.99,17.14 37.1,17.25 37.9,17.25 38.35,17.7 C8.2
N$27
  Bottom 0.152: U1.17 29.99,17.04 30.85,17.9 32.85,17.9 33.73,18.78 R8.2
N$28
  Bottom 0.152: 31.57,18.78 D1.ANODE 32.5,19.76 32.5,20.25 32.8,20.55 33.73,20.55 R8.1 33.73,22.21 R23.2 35.27,22.28 C11.2
N$29
  Top 0.152: R21.1 49.45,18.75 49.7,19 51.6,19 D6.A 52.2,20.3 53.2,21.3 54.6,21.3 54.8,21.1 U$11.3
N$30
  Top 0.152: R24.2 51.7,22.5 D6.K 52.2,21.3 51.5,20.6 50.64,20.6 U$20.2 50.37,20.4 49.5,20.4
N$31
  Top 0.152: U$20.4 46.8,21.59 R25.1
N$32
  Top 0.152: 56.05,17.2 R37.1 56.15,17.3 56.7,17.3 57.13,17.73 57.13,20.12 3.I/O
  Bottom 0.152: 3.I/O 58.25,21.24
N$33
  Top 0.152: U$21.6 53.5,18.2 53.7,18.4 54.3,18.4 | 54.3,18.4 R53.1 | U$21.5 54.15,18.25 54.3,18.4
N$34
  Top 0.152: U$14.2 51.36,25.06 52.1,25.8 D3.K 51.5,27 R27.2
N$35
  Top 0.152: R29.1 46.67,26.01 U$14.4
N$36  (via drill 0.35)
  Top 0.152: v50.6,14.3 R26.1 51.55,14.65 D2.A 52.7,15.3 52.9,15.5 52.9,16.07 53.01,16.18 53.01,16.21 53.3,16.5 54.5,16.5 54.8,16.2 U$21.3
N$37
  Top 0.152: R31.2 51.6,18.3 D2.K 52.2,17.3 52.7,16.8 52.7,16.5 52.2,16 51.7,16 51.5,16.21 U$23.2
N$38
  Top 0.152: R32.1 46.72,17.16 U$23.4
N$39
  Top 0.152: R11.1 59.21,9.54 Q2.G
N$40
  Top 0.152: R18.1 58.99,12.59 Q1.G
N$41  (via drill 0.35)
  Top 0.152: R14.2 64.44,8.11 63.75,8.8 63.75,10.44 64.33,11.01 R19.2 65.26,11.01 v65.95,11.7
  Bottom 0.152: JP2.2 63.7,12.97 63.7,11.9 64,11.6 65.85,11.6 v65.95,11.7
N$42
  Bottom 0.152: R33.2 38.67,3.28 44.52,3.28 45.23,2.57 IC4.6
N$43
  Bottom 0.152: R34.2 38.53,0.6 44.4,0.6 44.6,0.8 44.6,1.87 IC4.7
N$44
  Top 0.152: R28.1 58.08,26.55 1.I/O
N$45  (via drill 0.35)
  Top 0.152: v42.8,9.7 42.8,9.3 46.65,5.46 47.75,5.46 48.4,4.8 48.4,3.1 50.1,1.4 51.9,1.4 52.9,2.4 61.1,2.4 v61.7,3
  Bottom 0.152: 34.9,8.7 R52.1 35.6,9.4 41.4,9.4 R51.2 | R51.2 42.7,10.9 | IC3.15 63.41,2.8 61.8,2.8 61.7,2.9 v61.7,3 | v42.8,9.7 42.7,9.8 R51.2
N$46
  Top 0.152: U$21.2 54.15,15.15 54.3,15 54.35,15 R39.2 55.39,14.5 56.06,15.17 56.06,16 R37.2
N$47
  Top 0.152: IC5.4 46.25,4.6 C23.2
N$48  (via drill 0.35)
  Top 0.152: 45.35,2.7 IC5.3 | C10.2 45.45,1.75 IC5.3 | IC5.1 43.5,2.85 43.5,3.6 43.8,3.9 45.3,3.9 45.5,3.7 45.5,2.85 IC5.3 | IC5.3 46,3.35 v46.1,3.35 | v51.7,4.7 52,5 52,6.4 51.75,6.65 51.75,8.65 51.2,9.2 51.2,10.8 51.7,11.3 53.1,11.3 53.6,11.8 54.3,11.8 56.74,14.24 v57.07,14.24
  Bottom 0.152: 57.8,12.9 57.9,12.9 | D5.1 57.9,12.7 57.9,12.9 | v46.1,3.35 46.66,3.9 48,3.9 48.8,4.7 v51.7,4.7 | v57.07,14.24 57.37,14.24 57.9,13.7 57.9,12.9
N$49
  Top 0.152: RC_POWER.CATHODE 40.6,2.5 R42.2
N$50
  Bottom 0.152: R22.2 29.78,18.03 29.1,17.35 28.7,17.35 28.49,17.14 U1.20
N$53  (via drill 0.35)
  Top 0.152: v36.3,7.5 37.9,7.5 39.35,6.06 39.35,4.96 v39.45,5.06
  Bottom 0.152: U$5.1 42.1,14.9 R47.1 41.9,14.3 41.3,13.7 41.3,11.7 40.3,10.7 34.6,10.7 34,10.1 34,7.7 34.4,7.3 36.1,7.3 v36.3,7.5 | 36.57,2.58 R33.1 36.4,2.61 36.4,3.3 36.6,3.5 38,3.5 38.4,3.9 39.1,3.9 39.45,4.25 v39.45,5.06
N$54  (via drill 0.35)
  Top 0.152: v42.24,17.54 43.3,16.49 43.3,14.2 v42.7,13.6 | v34.8,9.7 34.8,7 35.1,6.7 37.9,6.7 38.7,5.9 38.7,4.3 38.5,4.1 36.1,4.1 v35.6,3.6
  Bottom 0.152: U$5.4 42.21,18.71 R48.1 42,17.79 v42.24,17.54 | R34.1 36.35,1.16 35.4,2.1 35.4,3.4 v35.6,3.6 | v42.7,13.6 42.4,13.6 41.8,13 41.8,11.2 40.6,10 35.1,10 v34.8,9.7
N$55  (via drill 0.35)
  Top 0.152: v41.2,24.8 30.35,24.8 v30.1,25.05 | IC1.23 v16.59,18.51 v16.6,18.5 | v19.3,19.8 20.4,20.9 22.8,20.9 23.4,21.5 24.8,21.5 25.2,21.1 28.5,21.1 29.2,21.8 v29.2,21.9
  Bottom 0.152: U$8.7 41.44,25.04 v41.2,24.8 | v16.6,18.5 17.4,18.5 18.7,19.8 v19.3,19.8 | v29.2,21.9 29.4,22.1 29.4,24.35 v30.1,25.05
N$56  (via drill 0.35)
  Top 0.152: v41.8,23.6 31.3,23.6 30.85,23.15 30.22,23.15 30.17,23.2 17.2,23.2 v16.6,22.6 | IC1.24 14.6,19.57 v14.6,20.1
  Bottom 0.152: U$8.6 41.97,23.77 v41.8,23.6 | v14.6,20.1 14.6,21.6 15.35,22.35 15.78,22.35 16.04,22.6 v16.6,22.6
N$57
  Bottom 0.152: U$8.1 55.2,26.31 R49.2 R43.1
N$58
  Bottom 0.152: R44.1 49.6,20.7 R50.2 | R50.2 50.7,20.8 | R50.2 50.8,21.3 50.6,21.5 47,21.5 46.4,22.1 46.4,24.2 47.1,24.9 50.4,24.9 52.81,22.5 U$8.4
N$59
  Bottom 0.152: U7.1 44.7,10.7 R45.1
N$60  (via drill 0.35)
  Top 0.152: IC1.26 12.76,22.16 v12.9,22.3 | v17.7,24.4 20.2,24.4 20.7,24.9 23.8,24.9 24.3,24.4 29.1,24.4 29.25,24.25 | 29.25,24.25 29.3,24.2 | 29.25,24.25 30.22,24.25 30.22,24.26 30.66,24.26 30.8,24.4 40.82,24.4 40.97,24.25 42.76,24.25 43.3,23.7 43.3,20.1 44.8,18.6 R46.2 44.4,17.9 44.4,16 47.5,12.9 v53.1,12.9
  Bottom 0.152: v12.9,22.3 13.6,23 15.3,23 16.7,24.4 v17.7,24.4 | v53.1,12.9 53.04,12.84 U7.3
N$61
  Top 0.152: U$9.5 54.2,27.5 54.3,27.6 | 54.3,27.6 55.25,27.6 R4.1 | 54.3,27.6 53.7,27.6 53.55,27.45 U$9.6
OE_PIN  (via drill 0.35)
  Top 0.152: IC1.22 17.39,17.71 17.8,17.3 17.8,15.5 v18.8,14.5 | R3.2 45.47,7.54 44.9,8.1 44.9,9.7 v45,9.8
  Bottom 0.152: v18.8,14.5 19,14.3 19,8.9 21.3,6.6 36.9,6.6 39.2,8.9 42.32,8.9 42.47,8.75 43.23,8.75 43.59,9.1 44.9,9.1 45,9 | IC4.23 45.2,7.71 45.2,8.8 45,9 | v45,9.8 45,9
RC_+B_3V3  (via drill 0.35)
  Top 0.152: 56.24,12.59 56.4,12.59 | 56.4,12.59 R18.2 57.24,13.4 57.6,13.4 58.2,14 59.7,14 v60.35,13.35 | 57,8.5 59.85,8.5 60.35,9 v60.35,13.35 | v60.35,13.35 60.35,13.45 60.9,14 64.6,14 v65,14.4 | 47.82,24.02 49,22.84 49,20.68 U$20.5 48.01,19.51 47.6,19.1 47.6,18.2 48,17.8 48.7,17.8 49.2,17.3 49.2,15.6 48.83,15.23 48.13,15.23 | 47.82,24.02 U$14.5 | 47.82,24.02 48.7,24.9 48.7,26.6 48.1,27.2 45.2,27.2 44.6,26.6 44.6,23.5 C17.2 | 56.46,12.64 56.4,12.59 | 48.13,15.23 U$23.5 48.1,14.81 49.3,13.6 v49.4,13.6 | 48.13,15.23 48.3,15.05 | v62.3,1.2 61.9,0.8 49.8,0.8 48,2.6 48,3.7 47.8,3.9 46.3,3.9 45.8,4.4 45.58,4.4 45.58,4.41 44.55,4.41 IC5.5 42.95,4.8 C22.2 RC_POWER.ANODE | v59.5,12.11 58.98,12.11 58.58,11.71 57.4,11.71 56.46,12.64 | 56.46,12.64 56.36,12.74 | v53.9,11.1 54,11.2 54.4,11.2 55,11.8 55.7,11.8 56.46,12.56 56.46,12.64 | C24.2 53.53,7.88 55.4,6 56.5,6 57,6.5 57,8.5 | R11.2 56.2,9.48 56.2,8.8 56.5,8.5 57,8.5
  Bottom 0.152: 61.53,12.17 v60.35,13.35 | 54.61,15.2 U$5.8 54.81,14.9 55.8,13.9 55.8,11.8 55.1,11.1 v53.9,11.1 53.9,9.8 53.59,9.49 51.82,9.49 49.4,11.9 v49.4,13.6 | JP2.1 64.61,14.01 v65,14.4 | C13.2 60.85,1.6 61.45,2.2 63.3,2.2 | 63.3,2.2 63.43,2.2 IC3.16 63.68,2.43 64.19,2.43 65.2,3.44 65.2,7.2 63.1,9.3 60.5,9.3 59.9,9.9 56.5,9.9 56.2,10.2 56.2,10.9 56.9,11.6 59,11.6 v59.5,12.11 | v62.3,1.2 63.3,2.2
RC_GND  (via drill 0.35)
  Top 0.152: v66.05,15.85 v66.05,17.7 v66.05,19.55 | v66.05,19.55 65.5,20.1 v64.45,20.1 63.36,21.19 3.GND | v66.05,19.55 v66.05,21.4 v66.05,23.25 | v64.25,22.4 65.1,23.25 v66.05,23.25 | v66.05,23.25 v66.05,25.1 | v66.05,25.1 66,25.05 v64.2,25.05 | v66.05,25.1 v66.05,26.9 v66.05,28.7 66.05,30.45 v66,30.5 v66,32.3 v64.3,32.3 v62.55,32.3 v62.55,30.5 v62.55,28.7 64.25,28.7 v64.3,28.65 v64.3,30.45 | 55.38,9.45 55.3,9.45 | 55.3,9.45 55.2,9.45 | 55.2,9.45 C24.1 | U$20.3 50.35,21.84 R24.1 50.3,22.5 50.3,22.6 | 49.2,25.7 49.5,26 U$14.3 50.33,26.93 R27.1 50.25,27.05 50.8,27.6 52.3,27.6 52.9,27 52.9,26.6 53.2,26.3 54.7,26.3 54.9,26.5 54.9,27 U$9.4 | 49.2,25.7 49.2,23.5 50.1,22.6 50.3,22.6 | R40.1 53.55,20.15 U$11.1 | v51,23.33 50.3,22.64 50.3,22.6 | R31.1 50.35,17.5 U$23.3 51.45,17.16 v51.9,16.7 | 49.2,25.7 49.2,27.1 v49.3,27.2 48.9,27.6 44.8,27.6 43.9,26.7 43.9,22.4 45,21.3 C17.1 | C22.1 40.75,4.8 41.4,4.15 41.4,2.5 R42.1 42.45,1.45 | U$21.4 54.8,17.3 54.5,17 53.2,17 53,17.2 53,18.4 v52.71,18.69 53.14,18.69 R40.1 | 53.5,19.1 R40.1 | U$9.1 53.55,24 R38.1 | v56.9,10.7 55.4,10.7 55.2,10.5 55.2,9.55 55.3,9.45 | C23.1 47.1,0.9 46.7,0.5 | 46.7,0.5 44.9,0.5 44.2,1.2 C10.1 | 42.5,1.4 42.45,1.45 | U$21.1 53.5,14.75 R39.1 54.41,13.84 v54.41,13.76 | v55.7,6.9 55.2,7.4 55.2,9.45 | 46.7,0.5 49.02,0.5 v49.1,0.58 | v52.8,3.8 53.2,4.2 v53.2,5.3 52.5,6 52.5,6.6 52.3,6.8 52.3,10.2 v52.1,10.4 | v54.5,4.9 55.1,5.5 56.92,5.5 v58.18,6.76 | v52.94,12.09 51.51,12.09 51.01,12.6 47.38,12.6 47.37,12.6 46.9,12.6 v45.8,13.7 | U$11.4 54.62,22.48 54.62,23 54.12,23.5 54.05,23.5 R38.1 | R38.1 53.5,23.9 v52.94,23.34 | 42.45,1.45 44.15,1.45 C10.1
  Top 0.152: C10.1 44.2,1.9 44.5,2.2 IC5.2 | v61.95,4.95 62,4.95 | 62,4.95 65.45,4.95 v66.15,4.25 v66.15,5.95 v66.15,7.65 | 62,4.95 62,6.8 v61.95,6.85 v60.2,5.1
  Bottom 0.152: R50.1 52.4,19.3 52.75,18.95 52.75,18.65 | 52.73,18.71 v52.71,18.69 52.75,18.65 | R50.1 51.9,21.2 51.9,21.5 51.4,22 47.3,22 46.91,22.4 46.91,23.4 47.41,23.9 49.7,23.9 49.8,24 50.33,24 v51,23.33 | 50.5,27.2 v49.3,27.2 | 50.5,27.2 52.67,25.04 U$8.2 U$8.3 53.37,23.77 v52.94,23.34 | R49.1 56.4,26.8 | 56.4,26.8 56.4,27 57.3,27.9 59.8,27.9 | 59.8,27.9 61.81,27.9 1.GND 2.GND 3.GND ST.GND | 50.5,27.2 50.8,27.5 55.7,27.5 56.4,26.8 | R51.1 43.5,11.5 44.5,11.5 44.8,11.8 44.8,12.5 45.14,12.84 U7.2 | v51.9,16.7 52.75,17.55 52.75,18.65 | 55.5,19.9 U$5.5 55.5,18.71 57.4,16.8 62.05,16.8 63.35,18.11 ST.GND | 55.5,19.9 59.3,19.9 59.5,20.1 59.5,27.6 59.8,27.9 | TH.GND ST.GND | v66.05,15.85 66.51,15.4 66.51,9.21 66.1,8.8 64.53,8.8 63.29,10.05 60.58,10.05 59.92,10.7 v56.9,10.7 | C13.1 59.2,1.55 59.2,5 | 59.2,5 59.2,6 58.47,6.74 58.15,6.74 | 58.15,6.74 IC3.8 55.87,6.74 v55.7,6.9 | R16.1 46.43,10.53 46.8,10.9 46.8,12.2 46.17,12.84 U7.2 | v49.1,0.58 49.28,0.58 50.9,2.2 50.9,2.52 50.85,2.57 50.85,3.16 50.8,3.2 51.4,3.8 v52.8,3.8 | v53.2,5.3 54.1,5.3 v54.5,4.9 | v58.18,6.76 58.15,6.74 | v54.41,13.76 54.57,13.6 55.2,13.6 55.4,13.4 55.4,12.2 54.9,11.7 53.34,11.7 52.97,12.07 | 52.97,12.07 v52.94,12.09 | U7.2 45.56,13.46 v45.8,13.7 | R50.1 54.7,20.7 55.5,19.9 | v52.1,10.4 52.5,10.8 52.8,10.8 52.97,10.97 52.97,12.07 | v60.2,5.1 60.1,5 59.2,5
  pour Top: 32.2,-4.6 32.2,-3.3 46.2,10.7 46.2,26.5 47,27.3 56,27.3 57.5,28.8 57.9,28.8 58.3,29.2 58.3,37.4 64.8,43.9 70.8,43.9 75.5,39.2 75.5,1.5 69.1,-4.9 32.5,-4.9
  pour Bottom (rank 6): 47.3,-7 53.2,-1.1 53.2,7.9 46.5,14.6 46.5,15.3 46.5,26.1 46.9,26.5 56.7,26.5 59.1,28.9 59.1,38 64.6,43.5 70.6,43.5 75,39.1 75,1.6 69.2,-4.2 68.7,-4.2 65.9,-7
RCH1  (via drill 0.35)
  Top 0.152: 59.14,11.45 Q1.S 57.25,11.14 57.09,11.3 56.4,11.3 56.2,11.1 55.1,11.1 54.4,10.4 53.1,10.4 52.8,10.1 52.8,6.8 53.8,5.8 53.8,4.1 54.1,3.8 v54.7,3.8
  Bottom 0.152: v58.5,4.4 58.2,4.1 58.1,4.1 58.07,4.14 IC3.4 56.08,4.14 55.78,3.84 54.74,3.84 v54.7,3.8
RCH2  (via drill 0.35)
  Top 0.152: v58,7.8 58.09,7.89 Q2.S
  Bottom 0.152: IC3.7 55.12,6.09 54.9,6.3 54.9,7.6 55.1,7.8 v58,7.8
SCL  (via drill 0.35)
  Top 0.152: v21.65,19.45 23.9,17.2 23.9,14.95 25.1,13.75 31.3,13.75 v31.5,13.95 | IC1.28 11.16,19.54 11.3,19.4 12.95,19.4 v13.15,19.2 | v33.29,17.36 33.75,16.9 33.75,13.55 41.3,6 v41.7,6
  Bottom 0.152: v21.65,19.45 21.8,19.6 21.8,20.8 20.8,21.8 20.8,22.3 20.2,22.9 19.16,22.9 R7.2 18.83,24.67 18.5,25 17.5,25 16.15,26.36 13.45,26.36 | v31.5,13.95 31.5,14.05 32,14.55 U1.13 31.99,17.14 32.21,17.36 v33.29,17.36 | v13.15,19.2 13.15,19.85 12.3,20.7 12.3,27.5 | 13.45,26.35 13.45,26.36 | 13.45,26.36 12.3,27.5 | 12.3,27.5 IC2.5 | IC4.26 47.18,7.12 47.2,7.1 47.3,7.1 47.7,6.7 47.7,5.9 47.1,5.3 42.4,5.3 v41.7,6
SDA  (via drill 0.35)
  Top 0.152: 12.03,20.54 IC1.27 | v21.2,16.75 21.65,16.3 21.65,14.05 23.6,12.1 31.95,12.1 v32.7,12.85 33.45,12.85 40.2,6.1 v40.2,5.9 | IC1.27 11.81,20.76 | IC1.27 11.96,21.32 v11.51,21.78
  Bottom 0.152: v32.7,12.85 32.7,14.65 | U1.12 32.49,14.86 32.7,14.65 | U1.11 32.99,14.94 32.7,14.65 | IC2.3 8.4,28.26 11.75,24.9 11.75,22.02 v11.51,21.78 10.73,21.78 10.48,21.53 10.48,19.43 12.95,16.95 19.58,16.95 R9.2 20.47,17.48 v21.2,16.75 | v40.2,5.9 40.2,5 40.7,4.5 47.7,4.5 48.01,4.81 48.01,7.57 IC4.27
SEL  (via drill 0.35)
  Top 0.152: IC1.32 7.96,23.11 9.09,24.24 15.94,24.24 17.25,25.55 24.88,25.55 24.94,25.6 38.85,25.6 v38.95,25.7
  Bottom 0.152: v38.95,25.7 40.65,24 40.65,21.3 42.45,19.5 44.9,19.5 46.05,18.36 46.05,18.27 47.46,16.86 47.46,11.24 48.03,10.68 R16.2 49.14,9.86 52.5,6.5 52.5,5.1 55.42,2.19 IC3.1
VCC_RC  (via drill 0.35)
  Top 0.152: 1.VCC 60.56,26.35 59.3,27.6 56.75,27.6 R4.2 | 48.5,18.7 R21.2 49.05,18 49.3,18 49.7,17.6 49.7,14.3 50.4,13.6 52.2,13.6 52.65,14.05 R26.2 53.25,13.7 v53.6,13.7 54.1,13.2 55,13.2 56.7,14.9 56.7,16.2 57.3,16.8 59.58,16.8 TH.VCC | R53.2 56.55,20.55 56.9,20.9 56.9,21.8 57.7,22.6 59.8,22.6 60.82,23.62 2.VCC 59.53,25.1 57.05,25.1 R6.2 R15.2
  Top 1.27: TH.VCC ST.VCC
  Bottom 0.152: JP2.3 61.7,13.95 61.7,14.68 TH.VCC | D5.2 53.6,13.58 v53.6,13.7
  Bottom 1.27: 1.VCC 2.VCC 3.VCC ST.VCC | TH.VCC 60.82,15.94

### Text on the board
tPlace: REV 2.0.15 | RC | JS | RX | TX | G | Designed in Aizu | #612
bPlace: S/N | F-612-2-15-A-N-J-0-P | 3v3 | RC
Document: Y | X | O | #612 JetRacer Rev2.0.15
tDocu: OLED AREA | TX | GND | RX